# EasyEDA Pro project ProPrj_MN42_v2_2026-01-11.epro, board MOAR_Board
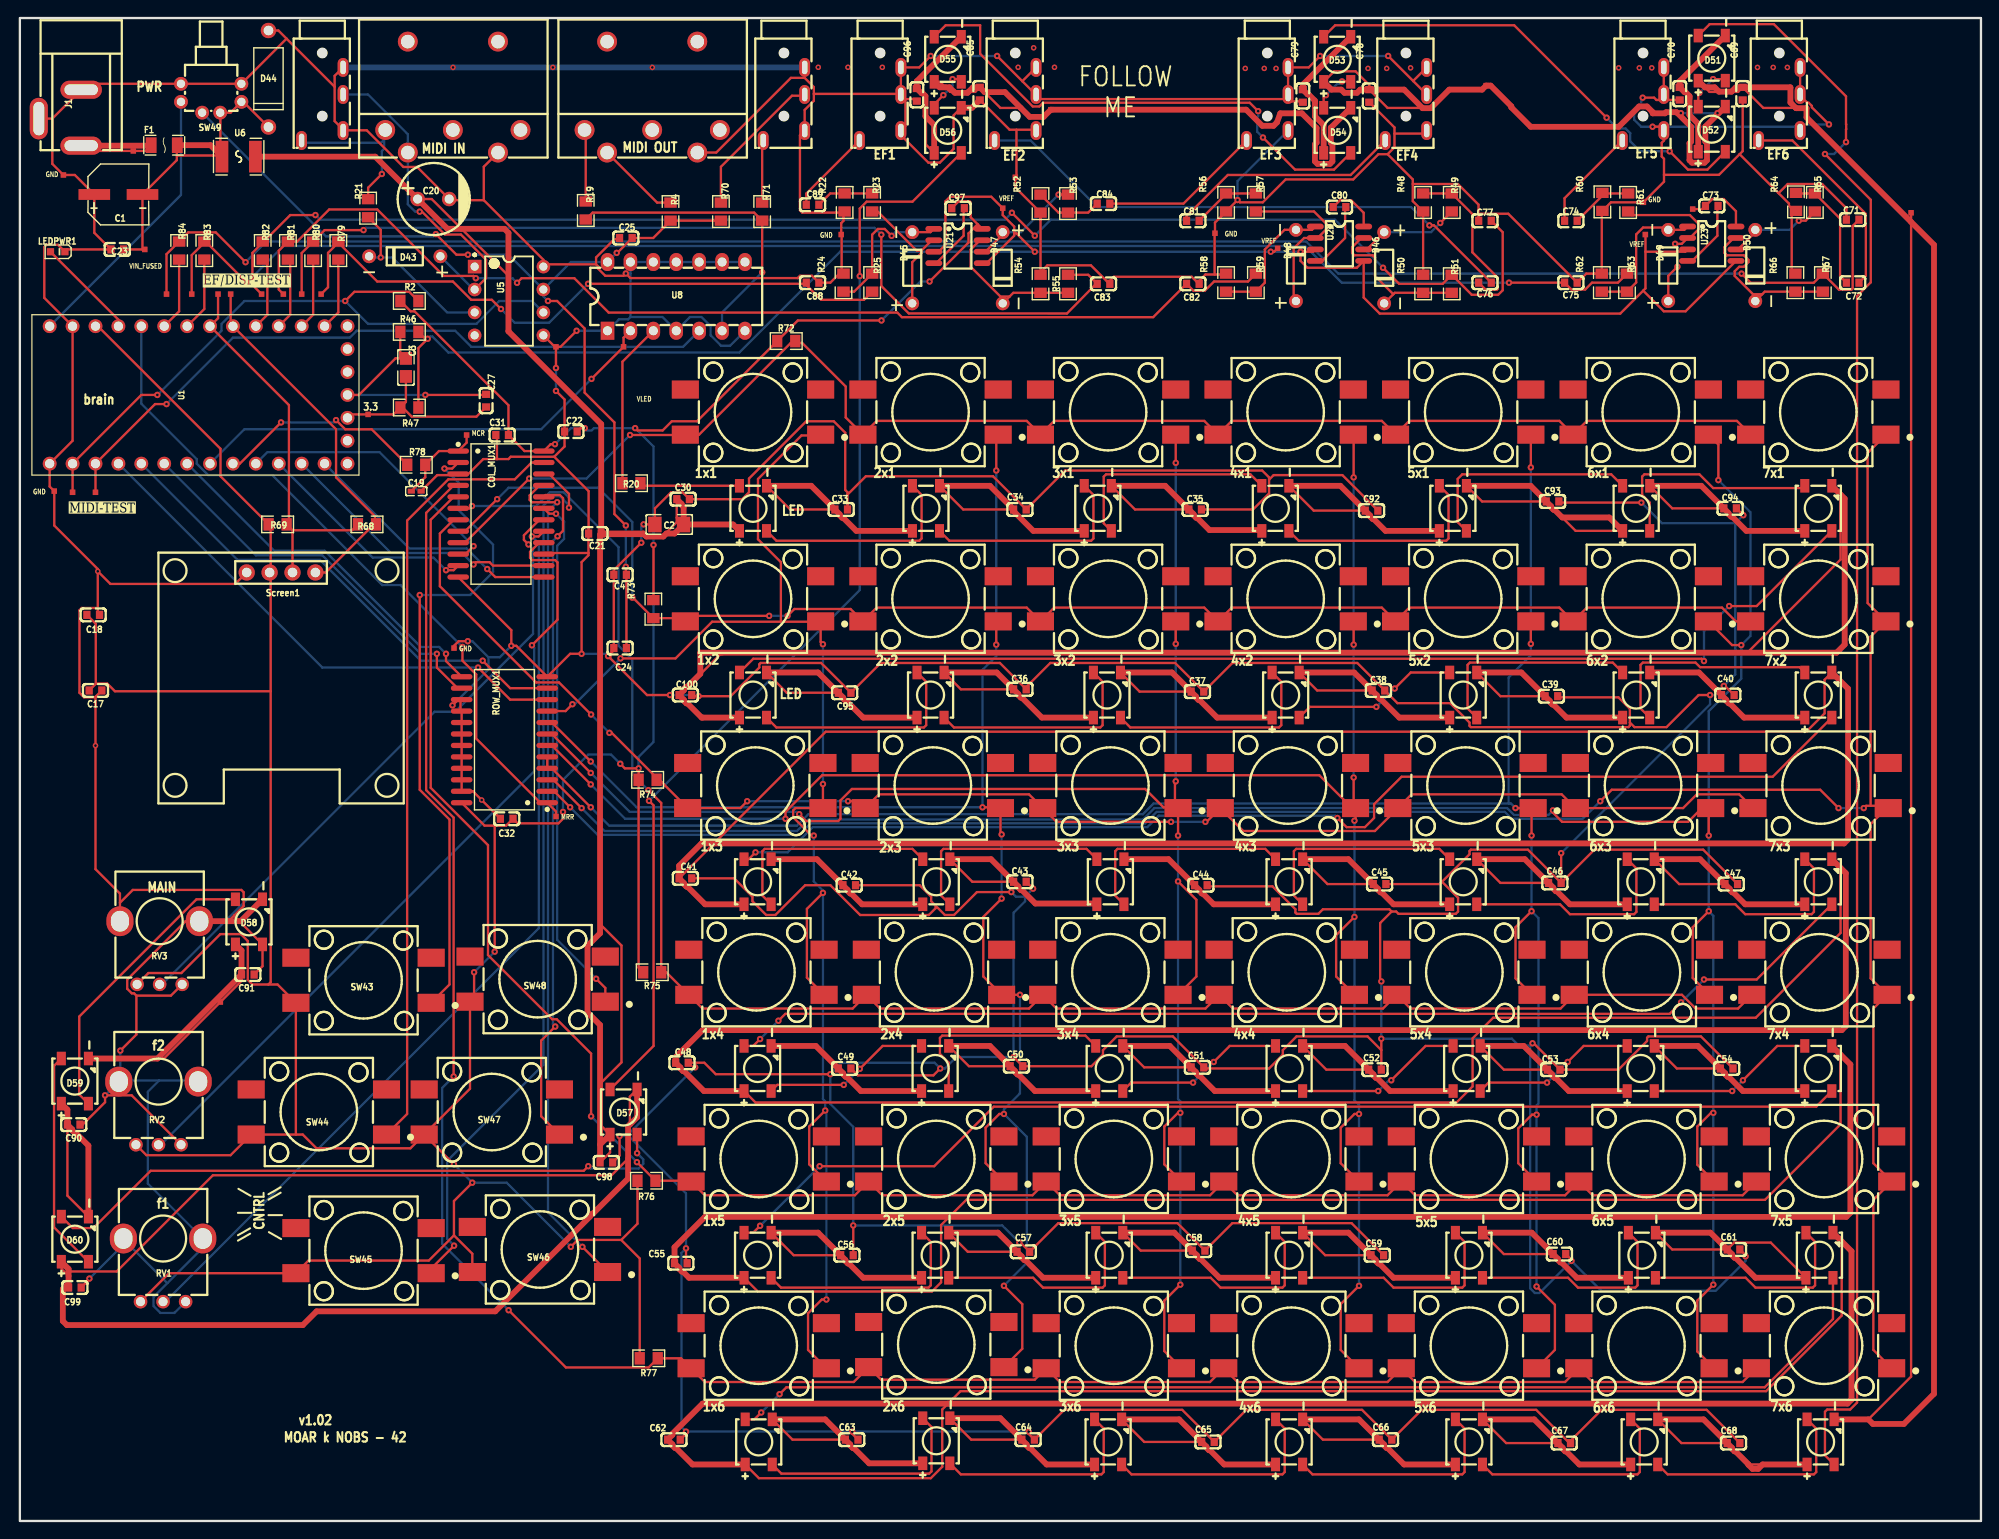
[diagram p4: board, top side]
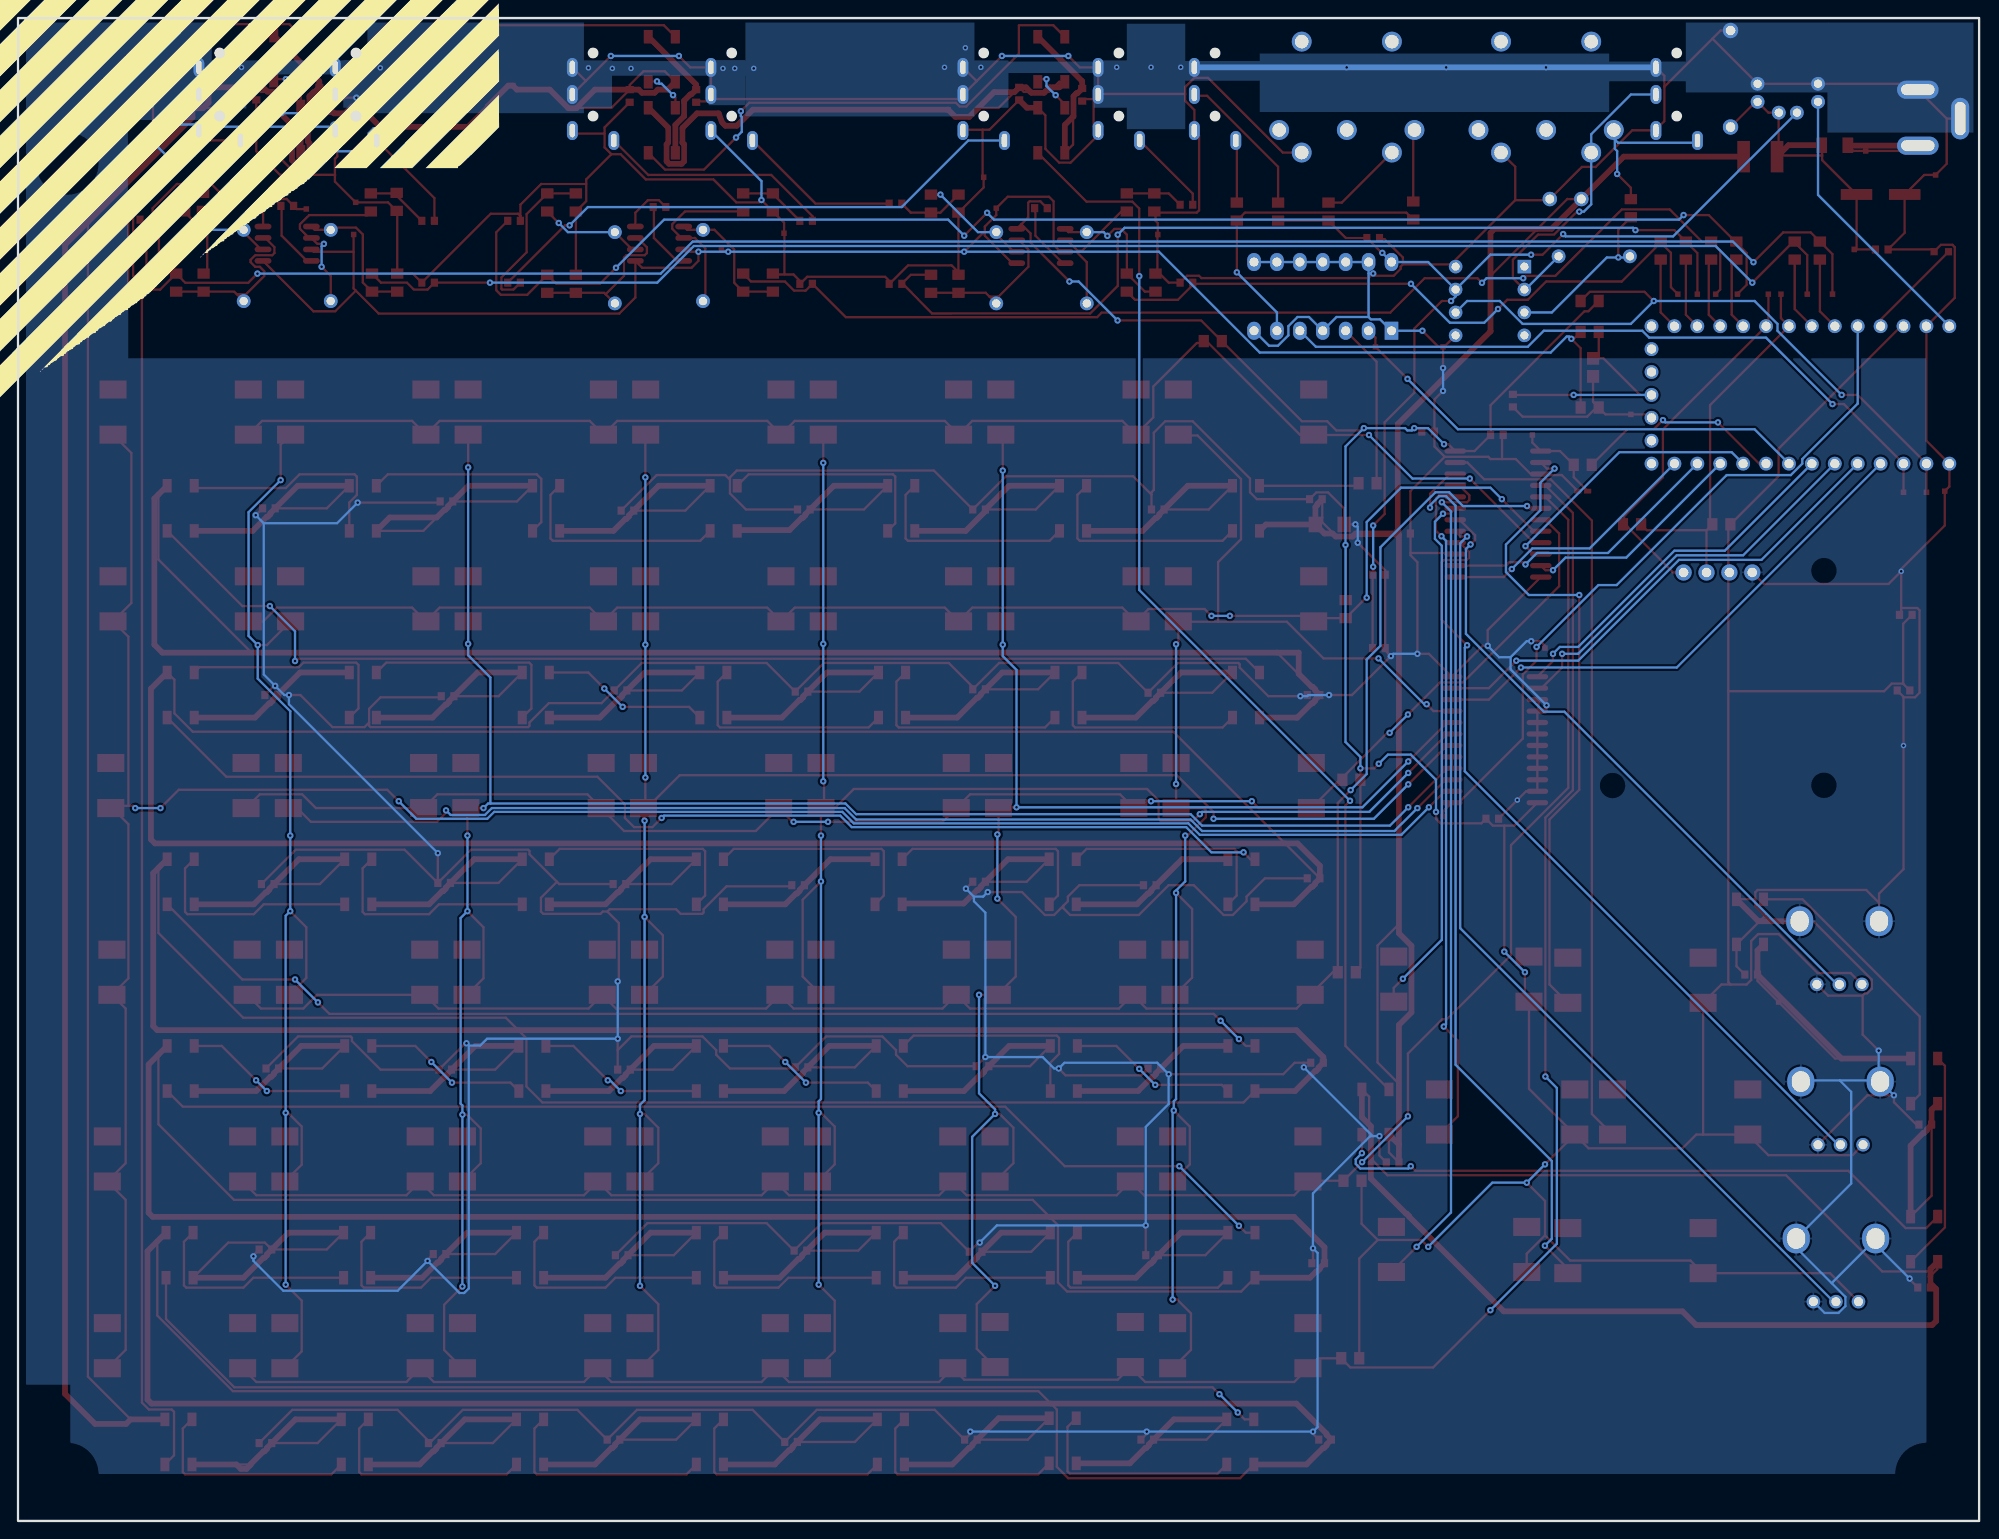
[diagram p5: board, bottom side, seen from below]

Outline 217.42 x 166.62 mm; copper layers: Top Layer, Bottom Layer. Coordinates in mm from the lower left corner of the outline.
Outline path: rectangle 0,166.62 217.42,0
Stack: Top Layer 0.035mm / Dielectric1 1.51mm FR4 er 4.5 / Bottom Layer 0.035mm

## Design rules (mm)
template: User Custom Config
spacing safeClearance (default): track to track 0.152, other pairs 0.152 to 0.3
track width trackWidth (default): min 0.152, default 0.254, max 2.54
differential pair differentialPair (default): width min 0.127, default 0.254, max 2.54; gap min 0.152, default 0.152
via viaSize (default): diameter min 0.61, default 0.711, max 10; hole min 0.3, default 0.305, max 5.999

## Placement (name value [footprint] x y rotation side)
C1  220uF  [CAP-SMD_BD6.3-L6.6-W6.6-LS7.4-FD]  10.92 147.07 0 top
C2  100uF  [C1206]  71.99 110.48 0 top
C3  4.7uF  [C0805]  42.8 127.89 270 top
C4  1uF  [C0603]  66.55 104.9 180 top
C17  1uF  [C0603]  8.38 92.08 0 top
C18  10uF  [C0603]  8.13 100.46 0 top
C19  4.7nF  [C0402]  43.94 114.17 180 top
C20  1000uF  [CAP-TH_BD8.0-P3.50-D0.6-FD]  45.85 146.56 0 top
C21  100nF  [C0603]  63.75 109.47 180 top
C22  100nF  [C0603]  61.09 120.78 0 top
C23  100nF  [C0603]  10.8 140.97 0 top
C24  100nF  [C0603]  66.55 96.77 180 top
C25  100nF  [C0603]  67.18 142.24 0 top
C27  100nF  [C0603]  51.69 124.21 270 top
C30  100nF  [C0603]  73.53 113.28 0 top
C31  100nF  [C0603]  53.47 120.4 0 top
C32  100nF  [C0603]  53.98 77.85 0 top
C33  100nF  [C0603]  91.06 112.14 0 top
C34  100nF  [C0603]  110.87 112.14 0 top
C35  100nF  [C0603]  130.3 112.14 180 top
C36  100nF  [C0603]  110.87 92.2 0 top
C37  100nF  [C0603]  130.56 91.95 0 top
C38  100nF  [C0603]  150.62 92.08 0 top
C39  1uF  [C0603]  169.8 91.44 0 top
C40  1uF  [C0603]  189.36 91.57 0 top
C41  100nF  [C0603]  73.79 71.25 0 top
C42  1uF  [C0603]  91.95 70.48 0 top
C43  1uF  [C0603]  110.87 70.87 0 top
C44  100nF  [C0603]  130.94 70.48 0 top
C45  1uF  [C0603]  150.75 70.61 0 top
C46  1uF  [C0603]  170.18 70.74 0 top
C47  100nF  [C0603]  189.74 70.61 0 top
C48  1uF  [C0603]  73.41 50.8 0 top
C49  1uF  [C0603]  91.44 50.16 0 top
C50  100nF  [C0603]  110.49 50.42 0 top
C51  1uF  [C0603]  130.56 50.29 0 top
C52  1uF  [C0603]  150.24 50.04 0 top
C53  100nF  [C0603]  170.05 50.04 0 top
C54  100nF  [C0603]  189.23 50.16 0 top
C55  100nF  [C0603]  73.28 28.57 0 top
C56  100nF  [C0603]  91.69 29.46 0 top
C57  100nF  [C0603]  111.25 29.84 0 top
C58  100nF  [C0603]  130.68 29.97 0 top
C59  100nF  [C0603]  150.5 29.46 0 top
C60  100nF  [C0603]  170.69 29.59 0 top
C61  100nF  [C0603]  189.99 30.1 0 top
C62  100nF  [C0603]  72.52 9.02 0 top
C63  100nF  [C0603]  92.22 9.02 0 top
C64  100nF  [C0603]  111.78 9.02 0 top
C65  100nF  [C0603]  131.72 8.76 0 top
C66  100nF  [C0603]  151.41 9.02 0 top
C67  100nF  [C0603]  171.22 8.64 0 top
C68  100nF  [C0603]  189.99 8.64 0 top
C69  100nF  [C0603]  191.01 158.24 270 top
C70  100nF  [C0603]  184.02 158.24 270 top
C71  100nF  [C0603]  203.2 144.27 180 top
C72  4.7uF  [C0603]  203.2 137.29 180 top
C73  1uF  [C0603]  187.58 145.8 180 top
C74  10uF  [C0603]  171.96 144.14 0 top
C75  100nF  [C0603]  171.96 137.29 0 top
C76  100nF  [C0603]  162.43 137.29 180 top
C77  4.7nF  [C0603]  162.43 144.15 180 top
C78  100nF  [C0603]  149.61 157.99 270 top
C79  100nF  [C0603]  142.24 157.99 270 top
C80  100nF  [C0603]  146.3 145.67 180 top
C81  100nF  [C0603]  130.05 144.14 0 top
C82  100nF  [C0603]  130.05 137.16 0 top
C83  100nF  [C0603]  120.14 137.16 0 top
C84  100nF  [C0603]  120.14 146.05 180 top
C85  100nF  [C0603]  106.43 158.24 270 top
C88  100nF  [C0603]  87.88 137.29 0 top
C89  100nF  [C0603]  87.88 145.92 0 top
C90  100nF  [C0603]  5.97 43.94 0 top
C91  100nF  [C0603]  25.27 60.58 0 top
C92  100nF  [C0603]  149.86 112.01 180 top
C93  100nF  [C0603]  169.93 113.03 180 top
C94  100nF  [C0603]  189.61 112.27 180 top
C95  100nF  [C0603]  91.44 91.82 0 top
C96  100nF  [C0603]  99.44 158.12 270 top
C97  100nF  [C0603]  104.01 145.54 180 top
C98  100nF  [C0603]  65.02 39.75 0 top
C99  100nF  [C0603]  6.1 25.88 0 top
C100  100nF  [C0603]  73.79 91.57 0 top
COL_MUX1  CD74HC4067M96  [SOIC-24_L15.4-W7.5-P1.27-LS10.3-BL]  53.34 111.63 270 top
D1  XL-5050RGBC-WS2812B  [LED-SMD_4P-L5.0-W5.0-BL_XL-5050RGBC]  81.28 112.27 0 top
D2  XL-5050RGBC-WS2812B  [LED-SMD_4P-L5.0-W5.0-BL_XL-5050RGBC]  100.46 112.27 0 top
D3  XL-5050RGBC-WS2812B  [LED-SMD_4P-L5.0-W5.0-BL_XL-5050RGBC]  119.51 112.27 0 top
D4  XL-5050RGBC-WS2812B  [LED-SMD_4P-L5.0-W5.0-BL_XL-5050RGBC]  139.19 112.27 0 top
D5  XL-5050RGBC-WS2812B  [LED-SMD_4P-L5.0-W5.0-BL_XL-5050RGBC]  158.88 112.27 0 top
D6  XL-5050RGBC-WS2812B  [LED-SMD_4P-L5.0-W5.0-BL_XL-5050RGBC]  179.2 112.27 0 top
D7  XL-5050RGBC-WS2812B  [LED-SMD_4P-L5.0-W5.0-BL_XL-5050RGBC]  199.39 112.27 0 top
D8  XL-5050RGBC-WS2812B  [LED-SMD_4P-L5.0-W5.0-BL_XL-5050RGBC]  81.28 91.57 0 top
D9  XL-5050RGBC-WS2812B  [LED-SMD_4P-L5.0-W5.0-BL_XL-5050RGBC]  100.96 91.57 0 top
D10  XL-5050RGBC-WS2812B  [LED-SMD_4P-L5.0-W5.0-BL_XL-5050RGBC]  120.52 91.57 0 top
D11  XL-5050RGBC-WS2812B  [LED-SMD_4P-L5.0-W5.0-BL_XL-5050RGBC]  140.33 91.57 0 top
D12  XL-5050RGBC-WS2812B  [LED-SMD_4P-L5.0-W5.0-BL_XL-5050RGBC]  160.02 91.57 0 top
D13  XL-5050RGBC-WS2812B  [LED-SMD_4P-L5.0-W5.0-BL_XL-5050RGBC]  179.2 91.57 0 top
D14  XL-5050RGBC-WS2812B  [LED-SMD_4P-L5.0-W5.0-BL_XL-5050RGBC]  199.39 91.57 0 top
D15  XL-5050RGBC-WS2812B  [LED-SMD_4P-L5.0-W5.0-BL_XL-5050RGBC]  81.79 70.87 0 top
D16  XL-5050RGBC-WS2812B  [LED-SMD_4P-L5.0-W5.0-BL_XL-5050RGBC]  101.6 70.87 0 top
D17  XL-5050RGBC-WS2812B  [LED-SMD_4P-L5.0-W5.0-BL_XL-5050RGBC]  120.9 70.87 0 top
D18  XL-5050RGBC-WS2812B  [LED-SMD_4P-L5.0-W5.0-BL_XL-5050RGBC]  140.72 70.87 0 top
D19  XL-5050RGBC-WS2812B  [LED-SMD_4P-L5.0-W5.0-BL_XL-5050RGBC]  160.02 70.87 0 top
D20  XL-5050RGBC-WS2812B  [LED-SMD_4P-L5.0-W5.0-BL_XL-5050RGBC]  179.7 70.87 0 top
D21  XL-5050RGBC-WS2812B  [LED-SMD_4P-L5.0-W5.0-BL_XL-5050RGBC]  199.39 70.87 0 top
D22  XL-5050RGBC-WS2812B  [LED-SMD_4P-L5.0-W5.0-BL_XL-5050RGBC]  81.79 50.16 0 top
D23  XL-5050RGBC-WS2812B  [LED-SMD_4P-L5.0-W5.0-BL_XL-5050RGBC]  101.47 50.16 0 top
D24  XL-5050RGBC-WS2812B  [LED-SMD_4P-L5.0-W5.0-BL_XL-5050RGBC]  120.78 50.16 0 top
D25  XL-5050RGBC-WS2812B  [LED-SMD_4P-L5.0-W5.0-BL_XL-5050RGBC]  140.72 50.16 0 top
D26  XL-5050RGBC-WS2812B  [LED-SMD_4P-L5.0-W5.0-BL_XL-5050RGBC]  160.4 50.16 0 top
D27  XL-5050RGBC-WS2812B  [LED-SMD_4P-L5.0-W5.0-BL_XL-5050RGBC]  179.7 50.16 0 top
D28  XL-5050RGBC-WS2812B  [LED-SMD_4P-L5.0-W5.0-BL_XL-5050RGBC]  199.39 50.16 0 top
D29  XL-5050RGBC-WS2812B  [LED-SMD_4P-L5.0-W5.0-BL_XL-5050RGBC]  81.79 29.46 0 top
D30  XL-5050RGBC-WS2812B  [LED-SMD_4P-L5.0-W5.0-BL_XL-5050RGBC]  101.47 29.46 0 top
D31  XL-5050RGBC-WS2812B  [LED-SMD_4P-L5.0-W5.0-BL_XL-5050RGBC]  120.78 29.46 0 top
D32  XL-5050RGBC-WS2812B  [LED-SMD_4P-L5.0-W5.0-BL_XL-5050RGBC]  140.72 29.46 0 top
D33  XL-5050RGBC-WS2812B  [LED-SMD_4P-L5.0-W5.0-BL_XL-5050RGBC]  160.66 29.46 0 top
D34  XL-5050RGBC-WS2812B  [LED-SMD_4P-L5.0-W5.0-BL_XL-5050RGBC]  179.83 29.46 0 top
D35  XL-5050RGBC-WS2812B  [LED-SMD_4P-L5.0-W5.0-BL_XL-5050RGBC]  199.52 29.46 0 top
D36  XL-5050RGBC-WS2812B  [LED-SMD_4P-L5.0-W5.0-BL_XL-5050RGBC]  81.92 8.76 0 top
D37  XL-5050RGBC-WS2812B  [LED-SMD_4P-L5.0-W5.0-BL_XL-5050RGBC]  101.6 8.89 0 top
D38  XL-5050RGBC-WS2812B  [LED-SMD_4P-L5.0-W5.0-BL_XL-5050RGBC]  120.65 8.76 0 top
D39  XL-5050RGBC-WS2812B  [LED-SMD_4P-L5.0-W5.0-BL_XL-5050RGBC]  140.72 8.76 0 top
D40  XL-5050RGBC-WS2812B  [LED-SMD_4P-L5.0-W5.0-BL_XL-5050RGBC]  160.66 8.76 0 top
D41  XL-5050RGBC-WS2812B  [LED-SMD_4P-L5.0-W5.0-BL_XL-5050RGBC]  180.09 8.76 0 top
D42  XL-5050RGBC-WS2812B  [LED-SMD_4P-L5.0-W5.0-BL_XL-5050RGBC]  199.64 8.76 0 top
D43  1N4148PF  [DO-35_BD1.9-L3.9-P7.90-D0.5-FD]  42.67 140.21 180 top
D44  SA6.0A  [DO-15_BD3.1-L6.7-P10.70-D0.8-RD]  27.56 159.89 90 top
D45  1N4148PF  [DO-35_BD1.9-L3.9-P7.90-D0.5-FD]  98.93 138.94 90 top
D46  1N4148PF  [DO-35_BD1.9-L3.9-P7.90-D0.5-FD]  151.26 138.94 270 top
D47  1N4148PF  [DO-35_BD1.9-L3.9-P7.90-D0.5-FD]  108.97 138.94 270 top
D48  1N4148PF  [DO-35_BD1.9-L3.9-P7.90-D0.5-FD]  141.48 139.19 90 top
D49  1N4148PF  [DO-35_BD1.9-L3.9-P7.90-D0.5-FD]  182.75 139.19 90 top
D50  1N4148PF  [DO-35_BD1.9-L3.9-P7.90-D0.5-FD]  192.41 139.19 270 top
D51  XL-5050RGBC-WS2812B  [LED-SMD_4P-L5.0-W5.0-BL_XL-5050RGBC]  187.58 162.18 0 top
D52  XL-5050RGBC-WS2812B  [LED-SMD_4P-L5.0-W5.0-BL_XL-5050RGBC]  187.58 154.31 0 top
D53  XL-5050RGBC-WS2812B  [LED-SMD_4P-L5.0-W5.0-BL_XL-5050RGBC]  146.05 162.05 0 top
D54  XL-5050RGBC-WS2812B  [LED-SMD_4P-L5.0-W5.0-BL_XL-5050RGBC]  146.05 154.18 0 top
D55  XL-5050RGBC-WS2812B  [LED-SMD_4P-L5.0-W5.0-BL_XL-5050RGBC]  102.87 162.05 0 top
D56  XL-5050RGBC-WS2812B  [LED-SMD_4P-L5.0-W5.0-BL_XL-5050RGBC]  102.87 154.18 0 top
D57  XL-5050RGBC-WS2812B  [LED-SMD_4P-L5.0-W5.0-BL_XL-5050RGBC]  66.93 45.34 0 top
D58  XL-5050RGBC-WS2812B  [LED-SMD_4P-L5.0-W5.0-BL_XL-5050RGBC]  25.4 66.42 0 top
D59  XL-5050RGBC-WS2812B  [LED-SMD_4P-L5.0-W5.0-BL_XL-5050RGBC]  6.1 48.77 0 top
D60  XL-5050RGBC-WS2812B  [LED-SMD_4P-L5.0-W5.0-BL_XL-5050RGBC]  6.1 31.24 0 top
F1  nSMD050-33V  [F1206]  16 152.53 0 top
J1  DC005  [DC-IN-TH_DC005]  4.45 155.57 270 top
J2  DIN-504B-M10  [CONN-TH_DIN-504B-M10]  48.01 157.86 180 top
J3  DIN-504B-M10  [CONN-TH_DIN-504B-M10]  70.1 157.86 180 top
J4  HC-PJ-320A  [AUDIO-TH_PJ-320A-4P-DIP]  95.38 157.1 270 top
J5  HC-PJ-320A  [AUDIO-TH_PJ-320A-4P-DIP]  110.36 157.1 270 top
J6  HC-PJ-320A  [AUDIO-TH_PJ-320A-4P-DIP]  138.3 157.1 270 top
J7  HC-PJ-320A  [AUDIO-TH_PJ-320A-4P-DIP]  153.67 157.1 270 top
J8  HC-PJ-320A  [AUDIO-TH_PJ-320A-4P-DIP]  179.96 157.1 270 top
J9  HC-PJ-320A  [AUDIO-TH_PJ-320A-4P-DIP]  195.07 157.1 270 top
J10  PJ-320A-4P DIP  [AUDIO-TH_PJ-320A-4P-DIP]  33.53 157.1 270 top
J11  PJ-320A-4P DIP  [AUDIO-TH_PJ-320A-4P-DIP]  84.71 157.1 270 top
LEDPWR1  XL-1608UGC-04  [LED0603-RD_GREEN]  4.19 140.72 180 top
NOREF  -  [Pad_e213]  13.84 140.97 0 top
NOREF#2  -  [Pad_e6020]  26.8 136.02 0 top
NOREF#3  -  [Pad_e6022]  31.24 136.02 0 top
NOREF#4  -  [Pad_e372]  162.56 159.13 0 top
NOREF#5  -  [Pad_e234]  49.53 120.4 0 top
NOREF#6  -  [Pad_e6015]  8.38 114.05 0 top
NOREF#7  -  [Pad_e236]  59.44 78.11 0 top
NOREF#8  -  [Pad_e954570]  3.81 114.17 0 top
NOREF#9  -  [Pad_e229]  185.46 145.45 0 top
NOREF#10  -  [Pad_e954937]  59.44 130.18 0 top
NOREF#11  -  [Pad_e6017]  66.93 130.18 0 top
NOREF#12  -  [Pad_e6023]  33.4 136.02 0 top
NOREF#13  -  [Pad_e954561]  48.13 96.77 0 top
NOREF#14  -  [Pad_e6035]  21.97 136.02 0 top
NOREF#15  -  [Pad_e146]  12.57 151.89 0 top
NOREF#16  -  [Pad_e955723]  180.21 142.62 0 top
NOREF#17  -  [Pad_e954935]  110.36 148.97 0 top
NOREF#18  -  [Pad_e954575]  4.83 149.22 0 top
NOREF#19  -  [Pad_e730]  180 146.19 180 top
NOREF#20  -  [Pad_e6013]  5.84 114.05 0 top
NOREF#21  -  [Pad_e6021]  29.21 136.02 0 top
NOREF#22  -  [Pad_e373]  209.68 145.03 0 top
NOREF#23  -  [Pad_e222]  108.97 145.54 0 top
NOREF#24  -  [Pad_e6029]  16.26 136.02 0 top
NOREF#25  -  [Pad_e370]  22.23 57.53 0 top
NOREF#26  -  [Pad_e223]  139.45 141.1 0 top
NOREF#27  -  [Pad_e215]  38.61 122.68 0 top
NOREF#28  -  [Pad_e6036]  23.37 136.02 0 top
NOREF#29  -  [Pad_e6019]  19.05 136.02 0 top
NOREF#30  -  [Pad_e726]  132.5 142.76 180 top
NOREF#31  -  [Pad_e371]  114.3 156.46 0 top
NOREF#32  -  [Pad_e724]  91.06 142.62 0 top
R2  4.7kΩ  [R0805]  43.18 135.25 0 top
R4  220Ω  [R0805]  72.14 145.16 270 top
R19  220Ω  [R0805]  62.74 145.29 270 top
R20  33Ω  [R0805]  67.8 115.05 0 top
R21  220Ω  [R0805]  38.61 145.54 90 top
R22  100kΩ  [R0805]  91.44 146.18 90 top
R23  10kΩ  [R0805]  94.49 146.18 90 top
R24  22kΩ  [R0805]  91.31 137.29 90 top
R25  10kΩ  [R0805]  94.49 137.29 270 top
R46  100kΩ  [R0805]  43.18 131.83 0 top
R47  100kΩ  [R0805]  43.18 123.44 0 top
R48  100kΩ  [R0805]  155.57 146.18 90 top
R49  10kΩ  [R0805]  158.75 146.18 90 top
R50  22kΩ  [R0805]  155.57 137.16 90 top
R51  10kΩ  [R0805]  158.75 137.16 90 top
R52  100kΩ  [R0805]  113.16 146.05 90 top
R53  10kΩ  [R0805]  116.2 146.05 270 top
R54  22kΩ  [R0805]  113.16 137.16 90 top
R55  10kΩ  [R0805]  116.2 137.16 90 top
R56  100kΩ  [R0805]  133.73 146.18 90 top
R57  10kΩ  [R0805]  137.03 146.18 90 top
R58  22kΩ  [R0805]  133.73 137.29 90 top
R59  10kΩ  [R0805]  137.03 137.29 90 top
R60  100kΩ  [R0805]  175.45 146.24 90 top
R61  100kΩ  [R0805]  178.31 146.18 90 top
R62  22kΩ  [R0805]  175.39 137.29 90 top
R63  10kΩ  [R0805]  178.18 137.29 90 top
R64  100kΩ  [R0805]  196.91 146.24 90 top
R65  100kΩ  [R0805]  199.01 146.18 90 top
R66  22kΩ  [R0805]  196.85 137.29 90 top
R67  10kΩ  [R0805]  199.9 137.29 90 top
R68  4.7kΩ  [R0805]  38.48 110.49 0 top
R69  4.7kΩ  [R0805]  28.58 110.49 0 top
R70  220Ω  [R0805]  77.72 145.16 270 top
R71  220Ω  [R0805]  82.3 145.16 270 top
R72  10kΩ  [R0805]  84.96 130.81 0 top
R73  10kΩ  [R0805]  70.23 101.09 270 top
R74  10kΩ  [R0805]  69.6 82.17 0 top
R75  10kΩ  [R0805]  70.1 60.83 0 top
R76  10kΩ  [R0805]  69.47 37.72 0 top
R77  10kΩ  [R0805]  69.72 18.03 0 top
R78  220Ω  [R0805]  43.94 117.09 180 top
R79  220Ω  [R0805]  35.31 140.84 270 top
R80  220Ω  [R0805]  32.51 140.84 270 top
R81  220Ω  [R0805]  29.72 140.84 270 top
R82  220Ω  [R0805]  26.92 140.84 270 top
R83  220Ω  [R0805]  20.45 140.84 270 top
R84  220Ω  [R0805]  17.65 140.84 270 top
ROW_MUX1  CD74HC4067M96  [SOIC-24_L15.4-W7.5-P1.27-LS10.3-BL]  53.72 86.61 90 top
RV1  10kΩ  [RES-ADJ-TH_RK09K1130A5R]  15.88 27.81 0 top
RV2  10kΩ  [RES-ADJ-TH_RK09K1130A5R]  15.37 45.21 0 top
RV3  10kΩ  [RES-ADJ-TH_RK09K1130A5R]  15.49 62.99 0 top
Screen1  HS96L03W2C03  [OLED-TH_L27.8-W27.2-P2.54_C9900033791]  28.96 105.16 0 top
SW1  HX B3F-4055-Y  [SW-SMD_4P-L12.0-W12.0-P5.00-LS15.5]  81.28 122.94 180 top
SW2  HX B3F-4055-Y  [SW-SMD_4P-L12.0-W12.0-P5.00-LS15.5]  100.96 122.94 180 top
SW3  HX B3F-4055-Y  [SW-SMD_4P-L12.0-W12.0-P5.00-LS15.5]  120.65 122.94 180 top
SW4  HX B3F-4055-Y  [SW-SMD_4P-L12.0-W12.0-P5.00-LS15.5]  140.33 122.94 180 top
SW5  HX B3F-4055-Y  [SW-SMD_4P-L12.0-W12.0-P5.00-LS15.5]  160.02 122.94 180 top
SW6  HX B3F-4055-Y  [SW-SMD_4P-L12.0-W12.0-P5.00-LS15.5]  179.7 122.94 180 top
SW7  HX B3F-4055-Y  [SW-SMD_4P-L12.0-W12.0-P5.00-LS15.5]  199.39 122.94 180 top
SW8  HX B3F-4055-Y  [SW-SMD_4P-L12.0-W12.0-P5.00-LS15.5]  81.28 102.23 180 top
SW9  HX B3F-4055-Y  [SW-SMD_4P-L12.0-W12.0-P5.00-LS15.5]  100.96 102.23 180 top
SW10  HX B3F-4055-Y  [SW-SMD_4P-L12.0-W12.0-P5.00-LS15.5]  120.65 102.23 180 top
SW11  HX B3F-4055-Y  [SW-SMD_4P-L12.0-W12.0-P5.00-LS15.5]  140.33 102.23 180 top
SW12  HX B3F-4055-Y  [SW-SMD_4P-L12.0-W12.0-P5.00-LS15.5]  160.02 102.23 180 top
SW13  HX B3F-4055-Y  [SW-SMD_4P-L12.0-W12.0-P5.00-LS15.5]  179.7 102.23 180 top
SW14  HX B3F-4055-Y  [SW-SMD_4P-L12.0-W12.0-P5.00-LS15.5]  199.39 102.23 180 top
SW15  HX B3F-4055-Y  [SW-SMD_4P-L12.0-W12.0-P5.00-LS15.5]  81.53 81.53 180 top
SW16  HX B3F-4055-Y  [SW-SMD_4P-L12.0-W12.0-P5.00-LS15.5]  101.22 81.53 180 top
SW17  HX B3F-4055-Y  [SW-SMD_4P-L12.0-W12.0-P5.00-LS15.5]  120.9 81.53 180 top
SW18  HX B3F-4055-Y  [SW-SMD_4P-L12.0-W12.0-P5.00-LS15.5]  140.59 81.53 180 top
SW19  HX B3F-4055-Y  [SW-SMD_4P-L12.0-W12.0-P5.00-LS15.5]  160.27 81.53 180 top
SW20  HX B3F-4055-Y  [SW-SMD_4P-L12.0-W12.0-P5.00-LS15.5]  179.96 81.53 180 top
SW21  HX B3F-4055-Y  [SW-SMD_4P-L12.0-W12.0-P5.00-LS15.5]  199.64 81.53 180 top
SW22  HX B3F-4055-Y  [SW-SMD_4P-L12.0-W12.0-P5.00-LS15.5]  81.66 60.83 180 top
SW23  HX B3F-4055-Y  [SW-SMD_4P-L12.0-W12.0-P5.00-LS15.5]  101.35 60.83 180 top
SW24  HX B3F-4055-Y  [SW-SMD_4P-L12.0-W12.0-P5.00-LS15.5]  120.9 60.83 180 top
SW25  HX B3F-4055-Y  [SW-SMD_4P-L12.0-W12.0-P5.00-LS15.5]  140.46 60.83 180 top
SW26  HX B3F-4055-Y  [SW-SMD_4P-L12.0-W12.0-P5.00-LS15.5]  160.15 60.83 180 top
SW27  HX B3F-4055-Y  [SW-SMD_4P-L12.0-W12.0-P5.00-LS15.5]  179.83 60.83 180 top
SW28  HX B3F-4055-Y  [SW-SMD_4P-L12.0-W12.0-P5.00-LS15.5]  199.52 60.83 180 top
SW29  HX B3F-4055-Y  [SW-SMD_4P-L12.0-W12.0-P5.00-LS15.5]  81.92 40.13 180 top
SW30  HX B3F-4055-Y  [SW-SMD_4P-L12.0-W12.0-P5.00-LS15.5]  101.6 40.13 180 top
SW31  HX B3F-4055-Y  [SW-SMD_4P-L12.0-W12.0-P5.00-LS15.5]  121.29 40.13 180 top
SW32  HX B3F-4055-Y  [SW-SMD_4P-L12.0-W12.0-P5.00-LS15.5]  140.97 40.13 180 top
SW33  HX B3F-4055-Y  [SW-SMD_4P-L12.0-W12.0-P5.00-LS15.5]  160.66 40.13 180 top
SW34  HX B3F-4055-Y  [SW-SMD_4P-L12.0-W12.0-P5.00-LS15.5]  180.34 40.13 180 top
SW35  HX B3F-4055-Y  [SW-SMD_4P-L12.0-W12.0-P5.00-LS15.5]  200.02 40.13 180 top
SW36  HX B3F-4055-Y  [SW-SMD_4P-L12.0-W12.0-P5.00-LS15.5]  81.92 19.43 180 top
SW37  HX B3F-4055-Y  [SW-SMD_4P-L12.0-W12.0-P5.00-LS15.5]  101.6 19.56 180 top
SW38  HX B3F-4055-Y  [SW-SMD_4P-L12.0-W12.0-P5.00-LS15.5]  121.29 19.43 180 top
SW39  HX B3F-4055-Y  [SW-SMD_4P-L12.0-W12.0-P5.00-LS15.5]  140.97 19.43 180 top
SW40  HX B3F-4055-Y  [SW-SMD_4P-L12.0-W12.0-P5.00-LS15.5]  160.66 19.43 180 top
SW41  HX B3F-4055-Y  [SW-SMD_4P-L12.0-W12.0-P5.00-LS15.5]  180.34 19.43 180 top
SW42  HX B3F-4055-Y  [SW-SMD_4P-L12.0-W12.0-P5.00-LS15.5]  200.02 19.43 180 top
SW43  HX 12x12x7.3TPFT-B  [SW-SMD_4P-L12.0-W12.0-P5.00-LS15.5]  38.1 59.94 180 top
SW44  HX 12x12x7.3TPFT-B  [SW-SMD_4P-L12.0-W12.0-P5.00-LS15.5]  33.15 45.34 180 top
SW45  HX 12x12x7.3TPFT-B  [SW-SMD_4P-L12.0-W12.0-P5.00-LS15.5]  38.1 29.97 180 top
SW46  HX 12x12x7.3TPFT-B  [SW-SMD_4P-L12.0-W12.0-P5.00-LS15.5]  57.66 30.1 180 top
SW47  HX 12x12x7.3TPFT-B  [SW-SMD_4P-L12.0-W12.0-P5.00-LS15.5]  52.32 45.34 180 top
SW48  HX 12x12x7.3TPFT-B  [SW-SMD_4P-L12.0-W12.0-P5.00-LS15.5]  57.4 60.07 180 top
SW49  TK-6580A-1  [SW-TH_TK-6580A-1]  21.21 157.73 180 top
U1  -  [teensy 4.0:MODULE_DEV-15583]  19.81 124.84 90 top
U5  6N138  [DIP-8_L9.8-W6.6-P2.54-LS7.6-BL]  54.23 135.25 270 top
U6  1812L200/33GR  [F1812]  24.26 151.26 0 top
U8  SN74AHCT125N  [PDIP-14_L19.3-W6.4-P2.54-LS7.6-BL]  72.77 135.76 0 top
U21  MCP6002DRG  [SOP-8_L4.9-W3.9-P1.27-LS6.0-BL]  104.01 141.35 270 top
U22  MCP6002DRG  [SOP-8_L4.9-W3.9-P1.27-LS6.0-BL]  146.3 141.6 270 top
U23  MCP6002DRG  [SOP-8_L4.9-W3.9-P1.27-LS6.0-BL]  187.58 141.6 270 top

## Footprints (pads in the part's own frame, mm; a bottom-side part is the same pattern mirrored in y, then rotated)
AUDIO-TH_PJ-320A-4P-DIP
  oval 2.1x1.2 hole 1.5x0.6: A(4.05,-2.3) B(-4.05,2.3) C(-1.05,2.3) D(2.95,2.3)
C0402
  rect 0.79x0.54 smd: 1(-0.545,0) 2(0.545,0)
C0603
  rect 0.8x0.9 smd: 1(-0.7,0) 2(0.7,0)
C0805
  rect 1.41x1.35 smd: 1(-1,0) 2(1,0)
C1206
  rect 1.485x1.728 smd: 1(-1.593,0) 2(1.593,0)
CAP-SMD_BD6.3-L6.6-W6.6-LS7.4-FD
  rect 3.5x1.2 smd: 1(-2.67,0) 2(2.67,0)
CAP-TH_BD8.0-P3.50-D0.6-FD
  round 1.6 hole 1: 1(-1.75,0) 2(1.75,0)
CONN-TH_DIN-504B-M10
  round 2.2 hole 1.5: 1(-7.5,3.65) 2(-5,6.15) 3(0,3.65) 4(5,6.15) 5(7.5,3.65) 6(-5,-6.15) 7(5,-6.15)
DC-IN-TH_DC005
  oval 2x4.6 hole 1.2x3.7: 1(3.1,2.35) 2(-3.1,2.35)
  oval 4.6x2 hole 3.7x1.2: 3(0.1,-2.35)
DIP-8_L9.8-W6.6-P2.54-LS7.6-BL
  rect 1.5x1.5 hole 0.9: 1(-3.81,-3.81)
  round 1.5 hole 0.9: 2(-1.27,-3.81) 3(1.27,-3.81) 4(3.81,-3.81) 5(3.81,3.81) 6(1.27,3.81) 7(-1.27,3.81) 8(-3.81,3.81)
DO-15_BD3.1-L6.7-P10.70-D0.8-RD
  round 1.7 hole 1.06: 1(-5.35,0) 2(5.35,0)
DO-35_BD1.9-L3.9-P7.90-D0.5-FD
  round 1.524 hole 0.914: 1(-3.95,0) 2(3.95,0)
F1206
  rect 1.19x1.728 smd: 1(-1.445,0) 2(1.445,0)
F1812
  rect 1.407x3.499 smd: 1(-1.853,0) 2(1.853,0)
LED0603-RD_GREEN
  rect 0.8x0.8 smd: 1(-0.799,-0.004) 2(0.799,0.004)
LED-SMD_4P-L5.0-W5.0-BL_XL-5050RGBC
  rect 1x1.5 smd: 1(-1.5,-2.5) 2(1.5,-2.5) 3(1.5,2.5) 4(-1.5,2.5)
OLED-TH_L27.8-W27.2-P2.54_C9900033791
  round 1.8 hole 1.05: 1(-3.81,0) 2(-1.27,0) 3(1.27,0) 4(3.81,0)
Pad_e146
  rect 0.61x0.61 smd: TP2(0,0)
Pad_e213
  rect 0.61x0.61 smd: TP3(0,0)
Pad_e215
  rect 0.61x0.61 smd: TP4(0,0)
Pad_e222
  rect 0.61x0.61 smd: TP5(0,0)
Pad_e223
  rect 0.61x0.61 smd: TP6(0,0)
Pad_e229
  rect 0.61x0.61 smd: TP7(0,0)
Pad_e234
  rect 0.61x0.61 smd: TP8(0,0)
Pad_e236
  rect 0.61x0.61 smd: TP9(0,0)
Pad_e370
  rect 0.61x0.61 smd: TP12(0,0)
Pad_e371
  rect 0.61x0.61 smd: TP12(0,0)
Pad_e372
  rect 0.61x0.61 smd: TP12(0,0)
Pad_e373
  rect 0.61x0.61 smd: TP12(0,0)
Pad_e724
  rect 0.61x0.61 smd: TP2(0,0)
Pad_e726
  rect 0.61x0.61 smd: TP2(0,0)
Pad_e730
  rect 0.61x0.61 smd: TP2(0,0)
Pad_e6013
  rect 0.61x0.61 smd: TP10(0,0)
Pad_e6015
  rect 0.61x0.61 smd: TP11(0,0)
Pad_e6017
  rect 0.61x0.61 smd: TP12(0,0)
Pad_e6019
  rect 0.61x0.61 smd: TP13(0,0)
Pad_e6020
  rect 0.61x0.61 smd: TP14(0,0)
Pad_e6021
  rect 0.61x0.61 smd: TP15(0,0)
Pad_e6022
  rect 0.61x0.61 smd: TP16(0,0)
Pad_e6023
  rect 0.61x0.61 smd: TP17(0,0)
Pad_e6029
  rect 0.61x0.61 smd: TP18(0,0)
Pad_e6035
  rect 0.61x0.61 smd: TP19(0,0)
Pad_e6036
  rect 0.61x0.61 smd: TP20(0,0)
Pad_e954561
  rect 0.61x0.61 smd: TP1(0,0)
Pad_e954570
  rect 0.61x0.61 smd: TP2(0,0)
Pad_e954575
  rect 0.61x0.61 smd: TP3(0,0)
Pad_e954935
  rect 0.61x0.61 smd: TP4(0,0)
Pad_e954937
  rect 0.61x0.61 smd: TP5(0,0)
Pad_e955723
  rect 0.61x0.61 smd: TP6(0,0)
PDIP-14_L19.3-W6.4-P2.54-LS7.6-BL
  rect 1.5x2 hole 1: 1(-7.62,-3.81)
  oval 1.5x2 hole 1: 2(-5.08,-3.81) 3(-2.54,-3.81) 4(0,-3.81) 5(2.54,-3.81) 6(5.08,-3.81) 7(7.62,-3.81) 8(7.62,3.81) 9(5.08,3.81) 10(2.54,3.81) 11(0,3.81) 12(-2.54,3.81) 13(-5.08,3.81) 14(-7.62,3.81)
R0805
  rect 1.133x1.377 smd: 1(-1,0) 2(1,0)
RES-ADJ-TH_RK09K1130A5R
  round 1.5 hole 1: 1(-2.5,-3.5) 2(0,-3.5) 3(2.5,-3.5)
  oval 3x3.3 hole 2x2.3: 4(4.4,3.5) 5(-4.4,3.5)
SOIC-24_L15.4-W7.5-P1.27-LS10.3-BL
  oval 0.574x2.388 smd: 1(-6.985,-4.744) 2(-5.715,-4.744) 3(-4.445,-4.744) 4(-3.175,-4.744) 5(-1.905,-4.744) 6(-0.635,-4.744) 7(0.635,-4.744) 8(1.905,-4.744) 9(3.175,-4.744) 10(4.445,-4.744) 11(5.715,-4.744) 12(6.985,-4.744) 13(6.985,4.744) 14(5.715,4.744) 15(4.445,4.744) 16(3.175,4.744) 17(1.905,4.744) 18(0.635,4.744) 19(-0.635,4.744) 20(-1.905,4.744) 21(-3.175,4.744) 22(-4.445,4.744) 23(-5.715,4.744) 24(-6.985,4.744)
SOP-8_L4.9-W3.9-P1.27-LS6.0-BL
  oval 0.63x1.865 smd: 1(-1.905,-2.683) 2(-0.635,-2.683) 3(0.635,-2.683) 4(1.905,-2.683) 5(1.905,2.683) 6(0.635,2.683) 7(-0.635,2.683) 8(-1.905,2.683)
SW-SMD_4P-L12.0-W12.0-P5.00-LS15.5
  rect 3x2 smd: 1(-7.5,2.5) 2(7.5,2.5) 3(-7.5,-2.5) 4(7.5,-2.5)
SW-TH_TK-6580A-1
  round 1.524 hole 0.914: 1(3.35,-1.6) 2(3.35,0.4) 3(-3.35,-1.6) 4(-3.35,0.4) 5(1,1.6) 6(-1,1.6)
teensy 4.0:MODULE_DEV-15583
  round 1.53 hole 1.02: 0(-7.62,13.97) 1(-7.62,11.43) 2(-7.62,8.89) 3(-7.62,6.35) 3.3V_1(-2.54,-16.51) 3.3V_2(7.62,11.43) 4(-7.62,3.81) 5(-7.62,1.27) 6(-7.62,-1.27) 7(-7.62,-3.81) 8(-7.62,-6.35) 9(-7.62,-8.89) 10(-7.62,-11.43) 11(-7.62,-13.97) 12(-7.62,-16.51) 13(7.62,-16.51) 14(7.62,-13.97) 15(7.62,-11.43) 16(7.62,-8.89) 17(7.62,-6.35) 18(7.62,-3.81) 19(7.62,-1.27) 20(7.62,1.27) 21(7.62,3.81) 22(7.62,6.35) 23(7.62,8.89) G1(-7.62,16.51) G2(0,-16.51) G3(7.62,13.97) ON-OFF(5.08,-16.51) PGM(2.54,-16.51) VBAT(-5.08,-16.51) VIN(7.62,16.51)

## Nets
3VDC: C17.1 C18.1 C22.2 C31.2 C32.2 C97.2 COL_MUX1.24 R2.1 R69.1 R72.1 R73.1 R74.1 R75.1 R76.1 R77.1 ROW_MUX1.24 RV1.1 RV2.1 RV3.1 Screen1.2 SW43.2 SW44.2 SW45.2 SW46.2 SW47.2 SW48.2 U1.3.3V_2 U21.8
5VDC: C4.1 C24.1 C25.2 R4.2 R70.2 SW49.5 U5.7 U8.14
GND: C1.1 C2.1 C4.2 C17.2 C18.2 C19.1 C20.2 C21.2 C22.1 C23.1 C24.2 C25.1 C30.2 C31.1 C32.1 C33.2 C34.2 C35.1 C36.2 C37.2 C38.2 C39.2 C40.2 C41.2 C42.2 C43.2 C44.2 C45.2 C46.2 C47.2 C48.2 C49.2 C50.2 C51.2 C52.2 C53.2 C54.2 C55.2 C56.2 C57.2 C58.2 C59.2 C60.2 C61.2 C62.2 C63.2 C64.2 C65.2 C66.2 C67.2 C68.2 C69.2 C70.2 C71.2 C75.2 C77.2 C78.2 C79.2 C82.2 C83.2 C85.2 C88.2 C90.2 C91.2 C92.1 C93.1 C94.1 C95.2 C96.2 C98.2 C99.2 C100.2 COL_MUX1.3 COL_MUX1.12 COL_MUX1.15 D44.2 D56.3 D58.2 D58.3 J1.2 J1.3 J2.2 J3.2 J4.B J4.C J4.D J5.B J5.C J5.D J6.B J6.C J6.D J7.B J7.C J7.D J8.B J8.C J8.D J9.B J9.C J9.D J10.B J10.D J11.B J11.D LEDPWR1.1 NOREF#8.TP2 NOREF#10.TP5 NOREF#13.TP1 NOREF#17.TP4 NOREF#18.TP3 NOREF#19.TP2 NOREF#30.TP2 NOREF#32.TP2 R22.1 R24.2 R48.1 R50.2 R52.1 R54.2 R56.1 R58.2 R60.1 R62.2 R64.1 R66.2 ROW_MUX1.12 ROW_MUX1.15 ROW_MUX1.16 ROW_MUX1.17 ROW_MUX1.18 ROW_MUX1.19 ROW_MUX1.20 ROW_MUX1.21 ROW_MUX1.22 ROW_MUX1.23 RV1.3 RV1.4 RV1.5 RV2.3 RV2.4 RV2.5 RV3.3 RV3.4 RV3.5 Screen1.1 SW49.1 SW49.3 U1.G1 U1.G3 U5.5 U5.8 U8.1 U8.4 U8.7 U8.8 U8.9 U8.10 U8.11 U8.12 U8.13
VIN_FUSED: C1.2 C23.2 D44.1 F1.2 NOREF.TP3 SW49.4 SW49.6 U6.1
VIN_RAW: F1.1 J1.1 NOREF#15.TP2
CNTRL_LED: D42.2 D51.4
CNTRLLP: C69.1 D42.3 D51.1 NOREF#22.TP12
COL1: COL_MUX1.9 R72.2 SW1.2 SW2.2 SW3.2 SW4.2 SW5.2 SW6.2 SW7.2
COL2: COL_MUX1.8 R73.2 SW8.2 SW9.2 SW10.2 SW11.2 SW12.2 SW13.2 SW14.2
COL3: COL_MUX1.7 R74.2 SW15.2 SW16.2 SW17.2 SW18.2 SW19.2 SW20.2 SW21.2
COL4: COL_MUX1.6 R75.2 SW22.2 SW23.2 SW24.2 SW25.2 SW26.2 SW27.2 SW28.2
COL5: COL_MUX1.5 R76.2 SW29.2 SW30.2 SW31.2 SW32.2 SW33.2 SW34.2 SW35.2
COL6: COL_MUX1.4 R77.2 SW36.2 SW37.2 SW38.2 SW39.2 SW40.2 SW41.2 SW42.2
CTRL1: COL_MUX1.2 SW43.1
CTRL2: COL_MUX1.23 SW44.1
CTRL3: COL_MUX1.22 SW45.1
CTRL4: COL_MUX1.21 SW46.1
CTRL5: COL_MUX1.20 SW47.1
CTRL6: COL_MUX1.19 SW48.1
E1: C88.1 NOREF#12.TP17 R25.2 R79.1
E2: C83.1 NOREF#3.TP16 R55.2 R80.1
E3: C82.1 NOREF#21.TP15 R59.2 R81.1
E4: C77.1 NOREF#2.TP14 R51.2 R82.1
E5: C75.1 NOREF#29.TP13 R63.2 R83.1
E6: C71.1 NOREF#24.TP18 R67.2 R84.1
FP1: COL_MUX1.17 RV1.2
FP2: COL_MUX1.16 RV2.2
LED: NOREF#11.TP12 U1.6 U8.2
LEDCNTRL: D1.4 R20.2
MAIN: COL_MUX1.18 RV3.2
MIDI_OUT: R19.2 R71.2 U8.6
MIDI_RX: NOREF#20.TP10 R2.2 U1.0 U5.6
MIDI_TX: NOREF#6.TP11 U1.1 U8.5
MRC: R78.2 U1.7
MRR: NOREF#7.TP9 ROW_MUX1.1 U1.22
MUXC1: COL_MUX1.10 U1.8
MUXC2: COL_MUX1.11 U1.9
MUXC3: COL_MUX1.14 U1.10
MUXC4: COL_MUX1.13 U1.11
MUXR1: ROW_MUX1.10 U1.2
MUXR2: ROW_MUX1.11 U1.3
MUXR3: ROW_MUX1.14 U1.4
MUXR4: ROW_MUX1.13 U1.5
ROW1: ROW_MUX1.9 SW1.1 SW8.1 SW15.1 SW22.1 SW29.1 SW36.1
ROW2: ROW_MUX1.8 SW2.1 SW9.1 SW16.1 SW23.1 SW30.1 SW37.1
ROW3: ROW_MUX1.7 SW3.1 SW10.1 SW17.1 SW24.1 SW31.1 SW38.1
ROW4: ROW_MUX1.6 SW4.1 SW11.1 SW18.1 SW25.1 SW32.1 SW39.1
ROW5: ROW_MUX1.4 ROW_MUX1.5 SW5.1 SW12.1 SW19.1 SW26.1 SW33.1 SW40.1
ROW6: ROW_MUX1.3 SW6.1 SW13.1 SW20.1 SW27.1 SW34.1 SW41.1
ROW7: ROW_MUX1.2 SW7.1 SW14.1 SW21.1 SW28.1 SW35.1 SW42.1
SCL: NOREF#14.TP19 R68.1 R69.2 Screen1.3 U1.19
SDA: NOREF#28.TP20 R68.2 Screen1.4 U1.18
TPWR: SW49.2 U1.VIN
VLED: C2.2 C20.1 C21.1 C30.1 C98.1 D1.1 D57.1 U6.2
VREF: NOREF#16.TP6 NOREF#23.TP5 NOREF#26.TP6 R46.2 R47.2 U21.3 U21.5 U22.3 U22.5 U23.3 U23.5
$1N66295: D35.2 D36.4
$1N66297: D15.2 D16.4
$1N66299: C53.1 D26.3 D27.1
$1N66303: C56.1 D29.3 D30.1
$1N66307: C92.2 D4.3 D5.1
$1N66319: C50.1 D23.3 D24.1
$1N66323: C35.2 D3.3 D4.1
$1N66327: D22.2 D23.4
$1N66329: C63.1 D36.3 D37.1
$1N66333: C38.1 D11.3 D12.1
$1N66337: C58.1 D31.3 D32.1
$1N66341: C45.1 D18.3 D19.1
$1N66348: D34.2 D35.4
$1N66350: C37.1 D10.3 D11.1
$1N66354: C47.1 D20.3 D21.1
$1N66358: C65.1 D38.3 D39.1
$1N66363: C44.1 D17.3 D18.1
$1N66367: C100.1 D7.3 D8.1
$1N66371: C36.1 D9.3 D10.1
$1N66375: D13.2 D14.4
$1N66377: C59.1 D32.3 D33.1
$1N66381: C42.1 D15.3 D16.1
$1N66385: C93.2 D5.3 D6.1
$1N66389: D19.2 D20.4
$1N66391: D20.2 D21.4
$1N66393: C62.1 D35.3 D36.1
$1N66399: C51.1 D24.3 D25.1
$1N66403: D21.2 D22.4
$1N66405: D32.2 D33.4
$1N66411: D12.2 D13.4
$1N66413: C94.2 D6.3 D7.1
$1N66418: D14.2 D15.4
$1N66420: D36.2 D37.4
$1N66422: C95.1 D8.3 D9.1
$1N66426: C67.1 D40.3 D41.1
$1N66431: C40.1 D13.3 D14.1
$1N66435: D7.2 D8.4
$1N66437: C60.1 D33.3 D34.1
$1N66441: C68.1 D41.3 D42.1
$1N66445: C52.1 D25.3 D26.1
$1N66449: C57.1 D30.3 D31.1
$1N66453: D33.2 D34.4
$1N66455: C43.1 D16.3 D17.1
$1N66462: C48.1 D21.3 D22.1
$1N66466: C34.1 D2.3 D3.1
$1N66470: C33.1 D1.3 D2.1
$1N66474: D31.2 D32.4
$1N66476: D2.2 D3.4
$1N66478: C54.1 D27.3 D28.1
$1N66482: C61.1 D34.3 D35.1
$1N66486: D28.2 D29.4
$1N66488: C46.1 D19.3 D20.1
$1N66492: D17.2 D18.4
$1N66494: D25.2 D26.4
$1N66496: C64.1 D37.3 D38.1
$1N66500: C49.1 D22.3 D23.1
$1N66504: C66.1 D39.3 D40.1
$1N66508: D3.2 D4.4
$1N66510: D26.2 D27.4
$1N66512: C39.1 D12.3 D13.1
$1N66516: D4.2 D5.4
$1N66518: D29.2 D30.4
$1N66520: D39.2 D40.4
$1N66522: D18.2 D19.4
$1N66524: D5.2 D6.4
$1N66528: D11.2 D12.4
$1N66530: C41.1 D14.3 D15.1
$1N66534: D23.2 D24.4
$1N66536: D30.2 D31.4
$1N66538: D27.2 D28.4
$1N66540: C55.1 D28.3 D29.1
$1N66544: D8.2 D9.4
$1N66546: D6.2 D7.4
$1N66548: D37.2 D38.4
$1N66550: D41.2 D42.4
$1N66552: D40.2 D41.4
$1N66554: D16.2 D17.4
$1N66556: D1.2 D2.4
$1N66558: D9.2 D10.4
$1N66560: D38.2 D39.4
$1N66562: D10.2 D11.4
$1N66564: D24.2 D25.4
$1N66632: J3.5 R19.1
$1N66634: J3.4 R4.1
$1N66635: D43.2 R21.1 U5.3
$1N66636: J2.5 J10.A R21.2
$1N66700: C3.2 C27.2 NOREF#27.TP4 R47.1 U1.3.3V_1
$1N66701: C3.1 C27.1 R46.1 U1.G2
$1N66704: LEDPWR1.2 U1.23
$1N66747: D51.2 D52.4
$1N66749: D52.2 D53.4
$1N66751: D53.2 D54.4
$1N66753: D54.2 D55.4
$1N66755: D55.2 D56.4
$1N66757: D56.2 D57.4
$1N66762: C70.1 D51.3 D52.1
$1N66766: C78.1 D52.3 D53.1 NOREF#4.TP12
$1N66770: C79.1 D53.3 D54.1
$1N66774: C85.1 D54.3 D55.1 NOREF#31.TP12
$1N66778: C96.1 D55.3 D56.1
$1N69436: D57.2 D60.4
$1N69466: C99.1 D57.3 D60.1
$1N69470: C90.1 D59.1 D60.3
$1N69481: C91.1 D58.1 D59.3 NOREF#25.TP12
$1N69498: D59.4 D60.2
$1N69571: D58.4 D59.2
$1N72269: D43.1 J2.4 J10.C U5.2
$1N72333: J11.C R70.1
$1N72386: J11.A R71.1
$1N75124: C19.2 COL_MUX1.1 NOREF#5.TP8 R78.1
$1N75213: R79.2 U1.14
$1N75256: R80.2 U1.15
$1N75299: R81.2 U1.16
$1N75342: R82.2 U1.17
$1N75385: R83.2 U1.20
$1N75428: R84.2 U1.21
$2N8142: C89.2 R22.2 R23.2
$2N8144: D45.1 R23.1 U21.2
$2N8145: D45.2 R24.1 R25.1 U21.1
$2N8148: C97.1 U21.4
$2N8619: C76.2 R48.2 R49.2
$2N8621: D46.1 R49.1 U22.6
$2N8622: D46.2 R50.1 R51.1 U22.7
$2N9096: C84.2 R52.2 R53.2
$2N9098: D47.1 R53.1 U21.6
$2N9099: D47.2 R54.1 R55.1 U21.7
$2N9573: C81.2 R56.2 R57.2
$2N9575: D48.1 R57.1 U22.2
$2N9576: D48.2 R58.1 R59.1 U22.1
$2N9579: C80.1 U22.4
$2N9580: C80.2 U22.8
$2N10050: C74.2 R60.2 R61.2
$2N10052: D49.1 R61.1 U23.2
$2N10053: D49.2 R62.1 R63.1 U23.1
$2N10056: C73.1 U23.4
$2N10057: C73.2 NOREF#9.TP7 U23.8
$2N10527: C72.2 R64.2 R65.2
$2N10529: D50.1 R65.1 U23.6
$2N10530: D50.2 R66.1 R67.1 U23.7
$2N19479: C84.1 J6.A
$2N19500: C89.1 J4.A
$2N19521: C81.1 J7.A
$2N19542: C76.1 J5.A
$2N19567: C74.1 J8.A
$2N19588: C72.1 J9.A
$3N903: R20.1 U8.3

Pads without a net: J2 1 3 6 7; J3 1 3 6 7; SW1 3 4; SW2 3 4; SW3 3 4; SW4 3 4; SW5 3 4; SW6 3 4; SW7 3 4; SW8 3 4; SW9 3 4; SW10 3 4; SW11 3 4; SW12 3 4; SW13 3 4; SW14 3 4; SW15 3 4; SW16 3 4; SW17 3 4; SW18 3 4; SW19 3 4; SW20 3 4; SW21 3 4; SW22 3 4; SW23 3 4; SW24 3 4; SW25 3 4; SW26 3 4; SW27 3 4; SW28 3 4; SW29 3 4; SW30 3 4; SW31 3 4; SW32 3 4; SW33 3 4; SW34 3 4; SW35 3 4; SW36 3 4; SW37 3 4; SW38 3 4; SW39 3 4; SW40 3 4; SW41 3 4; SW42 3 4; SW43 3 4; SW44 3 4; SW45 3 4; SW46 3 4; SW47 3 4; SW48 3 4; U1 12 13 ON-OFF PGM VBAT; U5 1 4

## Via types
v1: diameter 0.711, hole 0.305, Top Layer to Bottom Layer, 240 vias
v2: diameter 0.61, hole 0.305, Top Layer to Bottom Layer, 24 vias

## Routing (per net, layer and track width the routed paths; a pad name or vN(x,y) marks a point on that pad's centre or on a via; arc(x,y) is an arc through that point)
3VDC: length 507.5
  Top Layer w0.254: C97.2 104.08,146.3 105.28,146.3 105.43,146.16 105.43,144.53 106.19,143.76 ; v1(68.22,121.16) 68.47,120.9 71.26,120.9 72.28,121.92 75.07,121.92 R72.1 86.25,133.1 v1(95.52,133.1) ; v1(50.36,60.83) 50.36,58.02 SW48.2 49.9,47.92 SW47.2 ; R76.1 68.47,32.96 66.67,31.16 ; R75.1 68.6,61.34 R74.1 v1(68.6,83.44) 67.07,83.44 v1(66.56,83.95) ; R2.1 43.32,134.11 43.75,134.11 54.17,123.7 C31.2 55.95,118.62 COL_MUX1.24 58.85,119.38 v1(59.33,119.38) ; SW47.2 v1(48.13,39.54) ; SW47.2 43.3,41.31 32.89,41.31 31.36,42.84 30.6,42.84 ; 30.6,42.84 SW44.2 23.36,40.55 14.03,40.55 RV2.1 ; 30.6,42.84 SW43.2 28.57,59.48 27.55,59.48 ; R77.1 68.72,29.1 66.67,31.16 ; U1.3.3V_2 8.65,132.46 22.24,118.87 22.24,115.82 R69.1 27.81,110.26 27.81,105.2 ; RV3.1 14.25,60.75 17.9,60.75 22.22,65.06 24.5,65.06 25.27,64.3 25.27,59.98 25.77,59.48 27.55,59.48 ; 52.64,77.09 51.52,77.09 ROW_MUX1.24 ; 52.64,77.09 53.91,77.09 C32.2 55.18,77.34 59.71,77.34 60.21,77.85 v1(60.21,78.61) ; 52.64,77.09 v1(52.64,63.12) ; 106.19,143.76 105.17,142.75 105.17,141.73 v1(100.85,137.41) ; 106.19,143.76 U21.8 ; C22.2 62.17,121.16 v1(62.63,121.16) ; 8.41,92.84 8.41,99.47 C18.1 ; 8.41,92.84 8.41,92.81 C17.1 ; 8.41,92.84 9.69,92.84 10.53,91.99 27.81,91.99 ; 48.13,31.66 50.16,29.63 SW46.2 ; 48.13,31.66 48.13,35.47 v1(50.16,37.5) ; 48.13,31.66 45.33,28.87 32,28.87 SW45.2 16.53,27.47 RV1.1 ; v1(61.08,30.39) 61.84,31.16 66.67,31.16 ; 27.55,59.48 27.81,59.73 27.81,91.99 ; R73.1 70.25,102.11 v1(70.25,108.2) ; 27.81,91.99 27.81,105.2 ; 27.81,105.2 Screen1.2
  Bottom Layer w0.254: v1(59.33,119.38) 61.1,121.16 v1(62.63,121.16) 62.88,120.9 63.39,120.9 63.64,121.16 v1(68.22,121.16) 70.25,119.13 v1(70.25,108.2) 70.25,86.36 68.6,84.71 v1(68.6,83.44) ; v1(61.08,30.39) 53.97,37.5 v1(50.16,37.5) v1(48.13,39.54) ; v1(60.21,78.61) 60.21,82.17 63.01,84.96 65.55,84.96 v1(66.56,83.95) ; v1(100.85,137.41) 99.84,137.41 v1(95.52,133.1) ; v1(52.64,63.12) v1(50.36,60.83)
5VDC: length 113.2
  Top Layer w0.254: v1(67.18,110.36) 65.91,111.63 65.91,121.79 62.61,125.09 62.61,132.21 59.56,135.25 v1(58.55,135.25) ; v1(66.17,140.59) 66.23,140.59 C25.2 70.22,142.24 R4.2 R70.2 ; v1(46.12,142.67) 48.4,140.39 v1(49.67,140.39) ; v1(67.18,105.79) 67.18,104.97 C4.1 C24.1
  Bottom Layer w0.254: v1(66.17,140.59) U8.14 61.09,139.57 U5.7 ; v1(58.55,135.25) 58.04,135.76 U5.7 ; U5.7 54.18,140.39 v1(49.67,140.39) ; SW49.5 33.92,142.42 45.86,142.42 v1(46.12,142.67) ; v1(67.18,110.36) v1(67.18,105.79)
GND: length 1994.5
  Top Layer w0.254: 110.49,154.24 110.49,149.1 NOREF#17.TP4 110.36,147.84 R52.1 113.16,138.45 ; 110.49,154.24 109.73,154.24 C85.2 ; 110.49,154.24 112.57,154.24 J5.D ; C82.2 130.68,137.22 130.68,137.43 ; C41.2 79.19,71.25 81.22,69.22 81.22,68.71 82.74,67.18 83.76,67.18 87.06,70.48 89.85,70.48 93.16,67.18 100.78,67.18 101.54,67.94 101.54,68.2 ; C83.2 120.78,137.22 120.78,137.43 ; 3.6,155.47 2.1,155.47 ; 3.6,155.47 J1.2 7.45,159.33 SW49.1 SW49.3 29.56,164.34 ; 3.6,155.47 3.6,150.46 NOREF#18.TP3 6.09,149.22 C1.1 8.25,142.81 10.1,140.97 5.24,140.97 LEDPWR1.1 4.23,141.48 2.96,141.48 2.7,141.23 2.7,135.6 U1.G3 5.84,119.76 U1.G1 3.3,114.68 NOREF#8.TP2 3.81,110.36 8.64,105.54 v2(8.64,105.28) ; 182.28,149.24 182.28,148.48 NOREF#19.TP2 176.4,146.19 R60.1 175.39,145.18 R62.2 173.66,138.29 C75.2 165.02,144.92 161.97,144.92 161.72,144.67 ; 182.28,149.24 182.28,151.02 182.03,151.27 182.03,152.8 182.28,153.05 182.28,154.07 ; 182.28,149.24 188.38,149.24 190.67,151.53 ; v1(179.77,112.9) 170.75,112.9 C93.1 ; C18.2 8.64,100.65 8.64,101.22 ; J8.B J8.C 182.2,158.09 182.2,157.54 ; C96.2 99.21,157.64 98.19,157.64 98.19,154.66 J4.D 97.68,153.64 100.73,150.59 101.99,150.59 103.52,152.12 103.52,155.83 D56.3 ; 196.7,145.24 196.44,144.99 196.44,138.69 R66.2 ; 196.7,145.24 196.14,145.8 196.14,146.06 194.98,147.21 ; 196.7,145.24 R64.1 ; 152.4,153.81 155.63,153.81 J7.D ; 152.4,153.81 152.4,154.49 C78.2 ; 152.4,153.81 152.4,152.29 151.64,151.53 ; C44.2 131.76,70.36 138.88,70.36 141.42,67.82 141.42,67.46 141.56,67.31 143.96,67.31 144.46,67.82 151.83,67.82 152.08,67.56 ; 152.08,67.56 150.81,66.29 150.81,59.94 v1(150.94,59.82) ; 152.08,67.56 152.59,67.56 152.85,67.31 159.2,67.31 159.45,67.56 159.45,69.09 157.67,70.87 ; 63.88,139.32 64.14,139.06 64.14,138.81 64.9,138.05 66.93,138.05 v1(67.18,138.3) 67.69,137.79 86.23,137.79 86.49,138.05 87.82,138.05 C88.2 89.85,137.29 90.85,138.29 91.11,138.29 ; 63.88,139.32 63.88,140.08 65.91,142.11 66.36,142.11 C25.1 ; 63.88,139.32 58.29,139.32 U5.8 58.04,139.83 51.44,146.43 ; 11.09,68.53 11.09,69.55 8.38,72.26 v2(8.38,85.96) 8.38,91.31 ; 11.09,68.53 RV3.5 ; 11.09,68.53 12.52,69.96 24.56,69.96 24.81,69.7 24.81,68.94 ; 24.81,68.94 26.88,68.94 D58.3 ; 24.81,68.94 24.81,68.18 23.79,67.16 ; C45.2 157.42,70.61 157.67,70.87 ; 182.2,157.54 C70.2 ; 182.2,157.54 181.44,157.54 181.19,157.8 v1(179.92,157.8) ; 171.67,8.76 168.11,12.32 155.41,12.32 152.11,9.02 148.81,12.32 135.98,12.32 C65.2 128.87,12.32 115.79,12.32 112.48,9.02 111.85,9.65 v1(111.85,9.91) ; 111.14,159.62 J5.B ; 111.14,159.62 112.61,158.15 J5.C 113.17,157.64 140.1,157.64 140.35,157.39 140.6,157.39 ; 111.14,159.62 v1(108.35,162.42) ; 151.64,151.53 154.43,148.73 154.43,148.22 ; 151.64,151.53 150.62,151.53 147.83,148.73 140.33,148.73 137.8,146.19 135.25,146.19 v1(135,146.45) R56.1 132.5,143.95 NOREF#30.TP2 132.46,142.72 132.46,138.19 ; 48.58,115.95 48.58,116.06 COL_MUX1.3 ; 48.58,115.95 46.27,115.95 C19.1 ; 48.58,115.95 49.59,115.95 51.37,117.73 52.89,117.73 ; v1(110.81,30.86) 110.94,30.86 C57.2 115.13,33.02 128.33,33.02 C58.2 134.43,33.02 147.64,33.02 151.19,29.46 ; v1(110.17,51.44) C50.2 118.81,50.42 120.08,51.69 120.08,52.2 121.6,53.72 127.83,53.72 C51.2 131.38,50.16 138.5,50.16 140.02,51.69 140.02,52.2 141.54,53.72 149.42,53.72 150.94,52.2 ; 59.24,117.98 63.05,114.17 C21.2 63.04,109.46 63.04,107.31 ; 59.24,117.98 54.42,117.98 54.16,117.73 52.89,117.73 ; 59.24,117.98 60.39,119.13 C22.1 60.39,124.33 v1(59.44,125.28) ; v1(151.7,162.42) 154.49,159.62 ; 154.49,159.62 154.49,159.67 J7.B ; 154.49,159.62 J7.C ; C91.2 26.9,61.51 D58.2 23.79,67.03 23.79,67.16 ; 91.31,145.05 R22.1 ; 91.31,145.05 91.31,144.14 91.06,143.89 NOREF#32.TP2 91.11,142.57 91.11,138.29 ; 91.31,145.05 86.74,145.05 86.49,145.3 86.49,153.63 J11.D 87.01,156.44 88.02,157.45 88.02,158.21 ; 190.67,151.53 191.01,151.87 C69.2 ; 190.67,151.53 194.98,147.21 ; 157.67,70.87 160.72,73.91 160.72,74.28 160.87,74.42 167.2,74.42 C46.2 ; 74.87,50.8 v1(74.87,50.29) ; 74.87,50.8 75.88,50.8 77.15,49.53 v1(89.85,49.53) ; 74.87,50.8 C48.2 ; J9.B J9.C 197.37,158.03 198.18,157.23 198.33,157.23 198.68,156.88 198.68,156.72 v1(200.57,154.83) ; v1(11.14,52.15) 12.91,53.92 12.91,58.24 ; v1(73.85,9.91) 73.85,9.65 C62.2 ; 91.76,113.79 C33.2 ; 91.76,113.79 91.76,114.05 91.51,114.3 91.51,120.65 90.23,121.92 87.19,121.92 80.84,115.57 80.84,114.05 80.08,113.28 C30.2 73.49,114.03 72.18,114.03 70.4,112.25 C2.1 70.39,110.49 v1(69.15,110.49) ; 91.76,113.79 93.79,115.82 107.89,115.82 111.57,112.14 115.89,116.46 137.73,116.46 138.5,115.7 138.5,115.44 ; 48.85,90.93 48.47,90.93 v1(47.96,90.42) ; 48.85,90.93 ROW_MUX1.15 ; 48.85,90.93 48.85,89.92 ROW_MUX1.16 ROW_MUX1.17 ROW_MUX1.18 ROW_MUX1.19 ROW_MUX1.20 ROW_MUX1.21 ROW_MUX1.22 ROW_MUX1.23 50.23,80.9 v2(51.2,79.93) C32.1 ; 12.91,58.24 16.74,58.24 RV3.3 ; 12.91,58.24 12.66,58.5 12.41,58.5 11.9,59 11.9,60.02 18.37,66.49 RV3.4 ; 138.5,115.44 139,115.95 146.62,115.95 C92.1 ; 138.5,115.44 138.5,113.92 136.72,112.14 C35.1 ; v1(102.05,50.16) 101.28,49.4 92.9,49.4 C49.2 ; Screen1.1 23.88,103.89 10.03,103.89 v2(8.64,105.28) ; 101.54,68.2 102.55,67.18 103.57,67.18 106.11,69.72 v1(109.92,69.72) ; 101.54,68.2 101.03,68.71 101.03,69.22 99.76,70.48 C42.2 ; 63.04,107.31 58.21,107.31 58.08,107.19 ; 63.04,107.31 63.04,107.06 62.28,106.3 v1(62.28,96.14) 61.01,96.14 ROW_MUX1.12 55.04,97.03 v1(54.48,97.03) 54.48,98.76 COL_MUX1.12 ; v1(100.98,162.42) 99.71,161.15 J4.B J4.C 97.61,158.21 88.02,158.21 ; 91.11,138.29 R24.2 ; 120.78,137.43 120.52,137.43 118.74,139.21 113.92,139.21 113.16,138.45 ; 120.78,137.43 121.29,137.94 129.92,137.94 130.43,137.43 130.68,137.43 ; 34.9,159 34.9,160.22 J10.B ; 34.9,159 29.56,164.34 ; 34.9,159 34.9,155.19 35.91,154.18 ; v1(92.39,32.77) C56.2 ; 52.89,117.73 52.89,120.27 C31.1 ; 23.79,67.16 23.12,66.49 ; C99.2 7.71,26.79 v1(7.71,26.87) ; v1(181.01,154.57) 181.78,154.57 182.28,154.07 ; 194.98,147.21 196,148.22 199.81,148.22 202.5,145.53 C71.2 ; 113.16,138.45 R54.2 ; 29.56,164.34 28.66,165.24 D44.2 ; J3.2 77.2,151.71 85.48,159.99 87.01,159.99 88.02,158.97 88.02,158.21 ; v1(61.72,131.95) 59.94,130.18 NOREF#10.TP5 ; 161.73,144.15 161.72,144.16 161.72,144.67 ; C55.2 73.85,28.7 v1(73.85,30.23) ; 8.64,101.22 v2(8.64,105.28) ; 8.64,101.22 6.86,101.22 6.6,100.97 6.6,91.82 7.11,91.31 8.38,91.31 ; v1(72.07,91.57) 69.53,91.57 65.47,95.63 65.47,96.14 ; C17.2 8.38,91.38 8.38,91.31 ; NOREF#10.TP5 59.31,130.18 U5.5 ; NOREF#10.TP5 v1(59.44,127.82) ; 154.43,148.22 154.43,146.32 R48.1 R50.2 ; 154.43,148.22 159.43,148.22 161.72,145.94 161.72,144.67 ; C98.2 66.49,40.51 v1(66.49,42.67) ; 182.28,154.07 J8.D ; 51.44,146.43 51.44,150.14 J2.2 ; 51.44,146.43 47.72,146.43 C20.2 44.04,150.11 42.52,150.11 38.45,154.18 35.91,154.18 ; v1(112.33,70.1) 111.57,70.87 ; v1(144.16,162.42) 142.89,161.15 J6.B J6.C 140.6,157.39 ; 130.68,137.43 131.44,138.19 132.46,138.19 ; 170.5,91.44 170.63,91.31 177.23,91.31 178.5,90.04 178.5,88.52 ; v1(191.33,29.34) 191.33,29.46 C61.2 ; 35.91,154.18 J10.D ; C47.2 186.63,74.42 174.56,74.42 C46.2 ; 150.94,52.2 v1(150.94,53.47) ; 150.94,52.2 C52.2 ; v1(68.9,108.46) 65.85,105.41 C4.2 C24.2 65.85,96.52 65.47,96.14 ; C60.2 172.02,28.96 v1(172.02,28.83) ; 132.46,138.19 133.64,138.19 R58.2 ; 140.6,157.39 142.14,157.39 C79.2 ; C68.2 187.01,12.32 175.35,12.32 171.79,8.76 171.92,8.64 ; 65.47,96.14 v1(65.21,95.88) ; RV2.3 12.39,47.19 v1(9.44,47.19) 9.44,46.43 6.96,43.94 C90.2 ; C46.2 v1(170.88,74.04) ; v1(92.29,9.91) 92.29,9.65 C63.2 ; C100.2 74.61,91.44 v1(75.25,91.44) 78.81,91.44 81.98,94.61 81.98,94.98 82.12,95.12 88.84,95.12 C95.2 95.44,95.12 108.65,95.12 111.44,92.33 ; 111.44,92.33 111.57,92.2 ; 111.44,92.33 114.24,95.12 128.08,95.12 C37.2 134.43,95.12 148.27,95.12 C38.2 152.73,90.67 158.57,90.67 160.72,88.52 160.72,88.16 160.87,88.01 178.35,88.01 178.5,88.16 178.5,88.52 ; 178.5,88.52 179.01,88.01 182.56,88.01 186.12,91.57 v1(187.39,91.57) ; NOREF#13.TP1 48.13,97.03 48.64,97.54 v1(49.66,97.54) ; v1(191.07,111.51) C94.1 ; v1(188.91,92.58) 189.04,92.58 C40.2 ; C54.2 186.37,53.72 180.55,53.72 180.41,53.57 180.41,53.21 177.23,50.04 C53.2 167.83,52.96 v1(167.7,52.96)
  Top Layer w0.635: D58.3 24.47,66.49 RV3.4 ; C85.2 105.56,156.68 D56.3
  Bottom Layer w0.254: v1(59.44,125.28) v1(59.44,127.82) ; 16.34,26.37 11.77,30.94 ; 16.34,26.37 20.28,30.3 20.28,31.31 14.18,37.4 14.18,47.57 15.45,48.84 ; 16.34,26.37 14.82,24.84 14.82,23.82 15.58,23.06 17.12,23.06 RV1.3 ; 11.77,30.94 v1(7.71,26.87) ; 11.77,30.94 11.48,31.23 RV1.5 ; v1(135,146.45) 135,148.55 J6.D ; 197.27,154.57 197.27,154.25 J9.D ; 197.27,154.57 v1(181.01,154.57) 179.74,154.57 178.98,155.34 178.98,156.1 179.49,156.61 179.49,156.86 179.74,157.12 179.74,157.37 179.92,157.54 v1(179.92,157.8) ; 197.27,154.57 197.52,154.83 v1(200.57,154.83) ; v1(65.21,95.88) 64.96,96.14 v1(62.28,96.14) ; v1(150.94,59.82) v1(150.94,53.47) 165.42,53.47 166.18,52.7 167.45,52.7 ; 15.45,48.84 11.14,48.84 ; 15.45,48.84 19.64,48.84 RV2.4 ; v1(110.81,30.86) 108.9,32.77 v1(92.39,32.77) 92.39,43.69 89.85,46.23 v1(89.85,49.53) 91.12,50.8 101.41,50.8 v1(102.05,50.16) 102.55,50.16 103.82,51.44 v1(110.17,51.44) 110.17,67.44 111.44,68.71 111.44,69.22 ; v1(69.15,110.49) 68.9,110.24 v1(68.9,108.46) ; 167.45,52.7 167.45,25.78 167.96,25.27 168.47,25.27 v1(172.02,28.83) 175.32,25.53 188.02,25.53 191.33,28.83 v1(191.33,29.34) ; 167.45,52.7 v1(167.7,52.96) ; v1(100.98,162.42) v1(108.35,162.42) ; 111.44,69.22 v1(112.33,70.1) ; 111.44,69.22 110.43,69.22 v1(109.92,69.72) ; 67.69,133.48 67.44,133.22 66.42,133.22 U8.1 v1(61.72,131.95) ; 67.69,133.48 67.69,138.3 ; 67.69,133.48 71.25,133.48 U8.4 74.3,133.48 75.56,133.48 76.58,132.46 76.58,131.44 77.73,130.29 78.73,130.29 U8.7 ; v1(47.96,90.42) 51.94,94.41 51.94,95.76 ; 67.69,138.3 U8.13 U8.11 U8.10 U8.9 U8.8 ; 67.69,138.3 v1(67.18,138.3) ; 51.94,95.76 53.21,95.76 v1(54.48,97.03) ; 51.94,95.76 50.17,97.54 v1(49.66,97.54) ; v1(170.88,74.04) 187.39,90.55 v1(187.39,91.57) 187.9,91.57 v1(188.91,92.58) 190.18,93.85 190.18,110.62 ; v1(72.07,91.57) 74.36,91.57 74.49,91.44 v1(75.25,91.44) ; 67.25,42.67 67.5,42.67 73.85,36.32 v1(73.85,30.23) 73.34,29.72 73.34,10.41 v1(73.85,9.91) v1(92.29,9.91) v1(111.85,9.91) ; 67.25,42.67 v1(66.49,42.67) ; 67.25,42.67 v1(74.87,50.29) ; v1(179.77,112.9) 182.06,110.62 190.18,110.62 ; 190.18,110.62 v1(191.07,111.51) ; 11.14,48.84 11.1,48.84 RV2.5 v1(9.44,47.19) ; 11.14,48.84 v1(11.14,52.15) ; v1(144.16,162.42) v1(151.7,162.42)
  Bottom Layer w0.635: J11.B v2(70.12,161.15) v2(59.09,161.15) v2(48.02,161.15) J10.B
  vias: v2(88.52,161.16) v2(91.81,161.16) v2(95.62,161.16) v2(110.68,161.16) v2(112.39,163.32) v2(114.71,161.16) v2(135.86,161.04) v2(137.96,161.04) v2(139.27,161.04) v2(149.47,161.04) v2(151.54,161.04) v2(154.18,161.1) v2(177.26,161.1) v2(179.55,161.1) v2(180.93,161.1) v2(192.65,161.15) v2(194.39,161.15) v2(195.96,161.15)
VIN_FUSED: length 37.8
  Top Layer w0.254: 17.4,151.38 17.4,152.48 F1.2 ; 17.4,151.38 17.4,150.88 C1.2 ; 17.4,151.38 22.23,151.38 ; 22.23,151.38 U6.1 ; 22.23,151.38 22.23,156.12 SW49.6 23.36,156.13 SW49.4 24.77,157.33 D44.1 ; NOREF.TP3 13.59,140.97 ; 13.59,140.97 C23.2 ; 13.59,140.97 13.59,147.06
  Top Layer w0.635: F1.2 21.13,152.53 U6.1
VIN_RAW: length 16
  Top Layer w0.254: 14.51,152.47 13.92,151.89 NOREF#15.TP2 7.38,151.89 J1.1
  Top Layer w0.635: F1.1 14.51,152.47 J1.1
CNTRL_LED: length 179.6
  Top Layer w0.254: D42.2 200.13,7.28 200.13,12.1 200.38,12.36 202.92,12.36 203.68,13.12 203.68,135.8 205.21,137.33 205.21,146.47 v1(200.13,151.55) ; v1(202.46,152.87) 202.46,154.3 202.48,154.31 202.48,154.84 202.46,154.85 202.46,157.95 194.46,165.95 187.35,165.95 D51.4
  Bottom Layer w0.254: v1(200.13,151.55) 201.14,151.55 v1(202.46,152.87)
CNTRLLP: length 322.9
  Top Layer w0.254: 204.94,11.26 209.68,16 NOREF#22.TP12 ; 186.82,158.94 187.32,158.43 190.5,158.43 C69.1 193.29,156.66 196.9,156.66 ; 198.06,156.66 198.08,156.63
  Top Layer w0.635: D42.3 204.94,11.26 205.45,10.75 208.88,10.75 212.22,14.1 212.22,141.48 198.08,155.61 198.08,156.63 196.93,156.63 196.3,157.26 196.3,158.92 196.28,158.94 C69.1 190.26,158.94 189.77,158.46 188.38,158.46 187.9,158.94 186.82,158.94 D51.1
COL1: length 165.3
  Top Layer w0.254: 85.72,130.6 85.46,130.6 75.3,120.44 SW1.2 73.74,120.4 v1(67.65,120.4) ; 85.72,130.6 R72.2 ; 85.72,130.6 86.73,130.6 91.56,125.77 91.56,122.34 SW2.2 94.99,121.96 111.63,121.96 SW3.2 114.67,121.96 131.31,121.96 SW4.2 134.36,121.96 151,121.96 SW5.2 154.04,121.96 170.68,121.96 SW6.2 173.73,121.96 190.37,121.96 SW7.2 ; COL_MUX1.9 49.36,108.46 v1(56.47,115.57)
  Bottom Layer w0.254: v1(56.47,115.57) 62.82,115.57 v1(67.65,120.4)
COL2: length 163.9
  Top Layer w0.254: 73.68,99.84 73.03,99.84 72.77,100.09 R73.2 67.96,102.36 v1(67.9,102.36) ; 73.68,99.84 74.19,100.35 v1(83.08,100.35) ; 73.68,99.84 SW8.2 ; SW14.2 190.24,99.73 188.71,101.26 173.73,101.26 SW13.2 170.68,101.26 154.04,101.26 SW12.2 151,101.26 134.36,101.26 SW11.2 131.31,101.26 114.67,101.26 SW10.2 111.63,101.26 94.99,101.26 SW9.2 92.09,101.11 85.87,101.11 v1(85.11,100.35) ; COL_MUX1.8 49.36,109.73 v1(52.91,113.28)
  Bottom Layer w0.254: v1(67.9,102.36) 67.9,110.74 64.09,114.55 54.18,114.55 v1(52.91,113.28) ; v1(83.08,100.35) v1(85.11,100.35)
COL3: length 172.2
  Top Layer w0.254: v1(63.33,89.41) 59.77,92.96 57.23,92.96 46.56,103.63 46.56,109.47 48.09,111 COL_MUX1.7 ; v1(91.81,79.8) 92.96,79.8 SW16.2 95.24,80.56 111.88,80.56 SW17.2 114.93,77.51 v1(127.63,77.51) ; v1(131.44,77.51) 131.56,77.51 SW18.2 135.63,76.49 150.23,76.49 SW19.2 154.3,80.56 170.94,80.56 SW20.2 184.4,79.03 185.92,80.56 190.62,80.56 SW21.2 ; v1(65.36,87.38) 65.61,87.38 70.6,82.39 R74.2 70.9,82.17 SW15.2 79.88,79.03 v1(80.64,79.8)
  Bottom Layer w0.254: v1(127.63,77.51) v1(131.44,77.51) ; v1(63.33,89.41) v1(65.36,87.38) ; v1(80.64,79.8) v1(91.81,79.8)
COL4: length 199.6
  Top Layer w0.254: v1(69.68,81.03) 71.1,79.6 R75.2 71.66,60.83 SW22.2 75.69,56.81 92.32,56.81 SW23.2 95.37,56.81 111.88,56.81 SW24.2 114.93,56.81 131.44,56.81 SW25.2 134.49,56.81 151.12,56.81 SW26.2 154.17,56.81 170.81,56.81 SW27.2 184.27,58.33 185.79,56.81 190.49,56.81 SW28.2 ; v1(50.12,112.52) 49.87,112.27 COL_MUX1.6
  Bottom Layer w0.254: v1(50.12,112.52) 57.23,112.52 58.76,114.05 60.28,114.05 66.38,107.95 66.38,97.03 67.9,95.5 67.9,82.8 v1(69.68,81.03)
COL5: length 217.7
  Top Layer w0.254: COL_MUX1.5 48.09,113.54 45.55,111 45.55,81.28 51.9,74.93 51.9,62.74 59.01,55.63 59.52,55.63 63.33,51.82 v1(63.33,44.86) ; v1(68.41,39.78) R76.2 74.33,37.72 SW29.2 75.94,36.11 92.58,36.11 SW30.2 95.62,36.11 112.26,36.11 SW31.2 115.31,36.11 131.95,36.11 SW32.2 134.99,36.11 151.63,36.11 SW33.2 154.68,36.11 171.32,36.11 SW34.2 174.36,36.11 191,36.11 SW35.2
  Bottom Layer w0.254: v1(63.33,44.86) v1(68.41,39.78)
COL6: length 247.4
  Top Layer w0.254: v1(54.18,23.37) 60.53,17.02 69.71,17.02 R77.2 73.31,18.03 SW36.2 75.94,15.41 92.45,15.41 SW37.2 95.5,15.66 112.52,15.66 SW38.2 115.31,15.41 131.95,15.41 SW39.2 134.99,15.41 151.63,15.41 SW40.2 154.68,15.41 171.32,15.41 SW41.2 174.36,15.41 191,15.41 SW42.2 ; COL_MUX1.4 48.09,114.81 45.04,111.76 45.04,81.03 48.09,77.98 v1(48.09,49.28)
  Bottom Layer w0.254: v1(48.09,49.28) 46.82,48.01 46.82,30.73 v1(54.18,23.37)
CTRL1: length 72.1
  Top Layer w0.254: v1(44.33,102.66) 44.33,81.07 47.63,77.76 47.63,59.48 SW43.1 ; COL_MUX1.2 47.93,116.68 v1(47.07,116.68)
  Bottom Layer w0.254: v1(44.33,102.66) 49.92,102.66 52.46,105.2 52.46,108.24 48.65,112.05 48.65,115.1 v1(47.07,116.68)
CTRL2: length 86.8
  Top Layer w0.254: COL_MUX1.23 56.74,117.35 54.87,115.48 47.51,115.48 42.93,110.91 42.93,45.12 SW44.1
CTRL3: length 100.1
  Top Layer w0.254: v1(60.88,112.35) 60.88,113.87 58.67,116.08 COL_MUX1.22 ; SW45.1 45.6,27.98 v1(48.14,30.52)
  Bottom Layer w0.254: v1(60.88,112.35) 60.88,112.6 59.86,113.62 59.1,113.62 58.05,112.56 58.05,50.59 47.38,39.92 47.38,31.28 v1(48.14,30.52)
CTRL4: length 94.2
  Top Layer w0.254: SW46.1 v1(62.36,30.39) ; COL_MUX1.21 57.62,114.81 56.52,113.7 56.52,113.2 56.78,112.94 v1(59.57,112.94)
  Bottom Layer w0.254: v1(59.57,112.94) 58.55,111.93 58.55,34.2 v1(62.36,30.39)
CTRL5: length 75
  Top Layer w0.254: v1(59.35,54.81) 57.79,53.25 57.79,44.87 SW47.1 ; COL_MUX1.20 58.29,113.74 59.86,113.74 60.22,113.39 60.22,109.78 v1(59.61,109.17)
  Bottom Layer w0.254: v1(59.61,109.17) 59.1,108.66 59.1,55.07 v1(59.35,54.81)
CTRL6: length 58.6
  Top Layer w0.254: v1(63.89,60.11) 64.9,59.09 SW48.1 ; v1(59.44,111.67) 58.68,111.67 COL_MUX1.19
  Bottom Layer w0.254: v1(63.89,60.11) 59.57,64.43 59.57,108.12 60.33,108.88 60.33,110.78 v1(59.44,111.67)
E1: length 72.6
  Top Layer w0.254: v1(53.34,134.37) 52.32,135.38 50.04,135.38 48.01,137.41 39.62,137.41 35.31,141.73 ; 35.31,141.73 34.16,140.59 34.16,136.78 NOREF#12.TP17 ; 35.31,141.73 R79.1 ; v1(62.99,137.16) 87.06,137.16 ; 87.06,137.16 C88.1 ; 87.06,137.16 88.83,135.38 93.58,135.38 R25.2
  Bottom Layer w0.254: v1(62.99,137.16) 58.67,132.84 54.86,132.84 v1(53.34,134.37)
E2: length 106.2
  Top Layer w0.254: v1(38.1,143.11) 33.78,143.11 R80.1 31.24,140.57 NOREF#3.TP16 ; R55.2 118.44,138.16 C83.1 119.32,137.16 116.09,133.87 98.55,133.87 95.5,136.92 v1(95.5,142.6)
  Bottom Layer w0.254: v1(95.5,142.6) 94.74,143.37 38.35,143.37 v1(38.1,143.11)
E3: length 123.2
  Top Layer w0.254: v1(55.12,137.27) 55.63,137.78 61.47,137.78 65.28,133.97 97.28,133.97 97.79,133.46 125.65,133.46 C82.1 130.11,136.4 131.38,136.4 132.4,137.41 136.16,137.41 R59.2 ; NOREF#21.TP15 28.7,136.53 28.7,140.83 R81.1 30.73,141.84 34.29,145.4 39.62,145.4 46.99,138.03 50.29,138.03 v1(50.55,137.78)
  Bottom Layer w0.254: v1(55.12,137.27) 54.61,137.78 v1(50.55,137.78)
E4: length 160.5
  Top Layer w0.254: 26.92,141.73 25.78,140.59 25.78,137.03 NOREF#2.TP14 ; 26.92,141.73 R82.1 ; 26.92,141.73 29.97,144.78 v1(32.77,144.78) ; v1(109.98,145.03) v1(112.52,142.49) ; v1(151.13,138.94) 152.91,137.16 157.75,137.16 R51.2 160.97,135.94 163.89,135.94 164.4,136.45 164.4,142.88 C77.1
  Bottom Layer w0.254: v1(109.98,145.03) 109.22,144.27 33.27,144.27 v1(32.77,144.78) ; v1(151.13,138.94) 145.8,144.27 114.3,144.27 v1(112.52,142.49)
E5: length 170.4
  Top Layer w0.254: 20.45,141.73 19.05,140.33 NOREF#29.TP13 ; 20.45,141.73 R83.1 ; 20.45,141.73 20.7,141.73 v1(25.15,137.29) ; R63.2 177.18,137.29 174.31,137.29 173.54,136.53 172.02,136.53 C75.1 v1(165.1,137.29)
  Bottom Layer w0.254: v1(25.15,137.29) 29.21,141.35 142.49,141.35 146.56,137.29 v1(165.1,137.29)
